# EAGLE schematic GTA04b7 (EAGLE 7.4.0), part 2 of 3
## Sheet 16 of 38
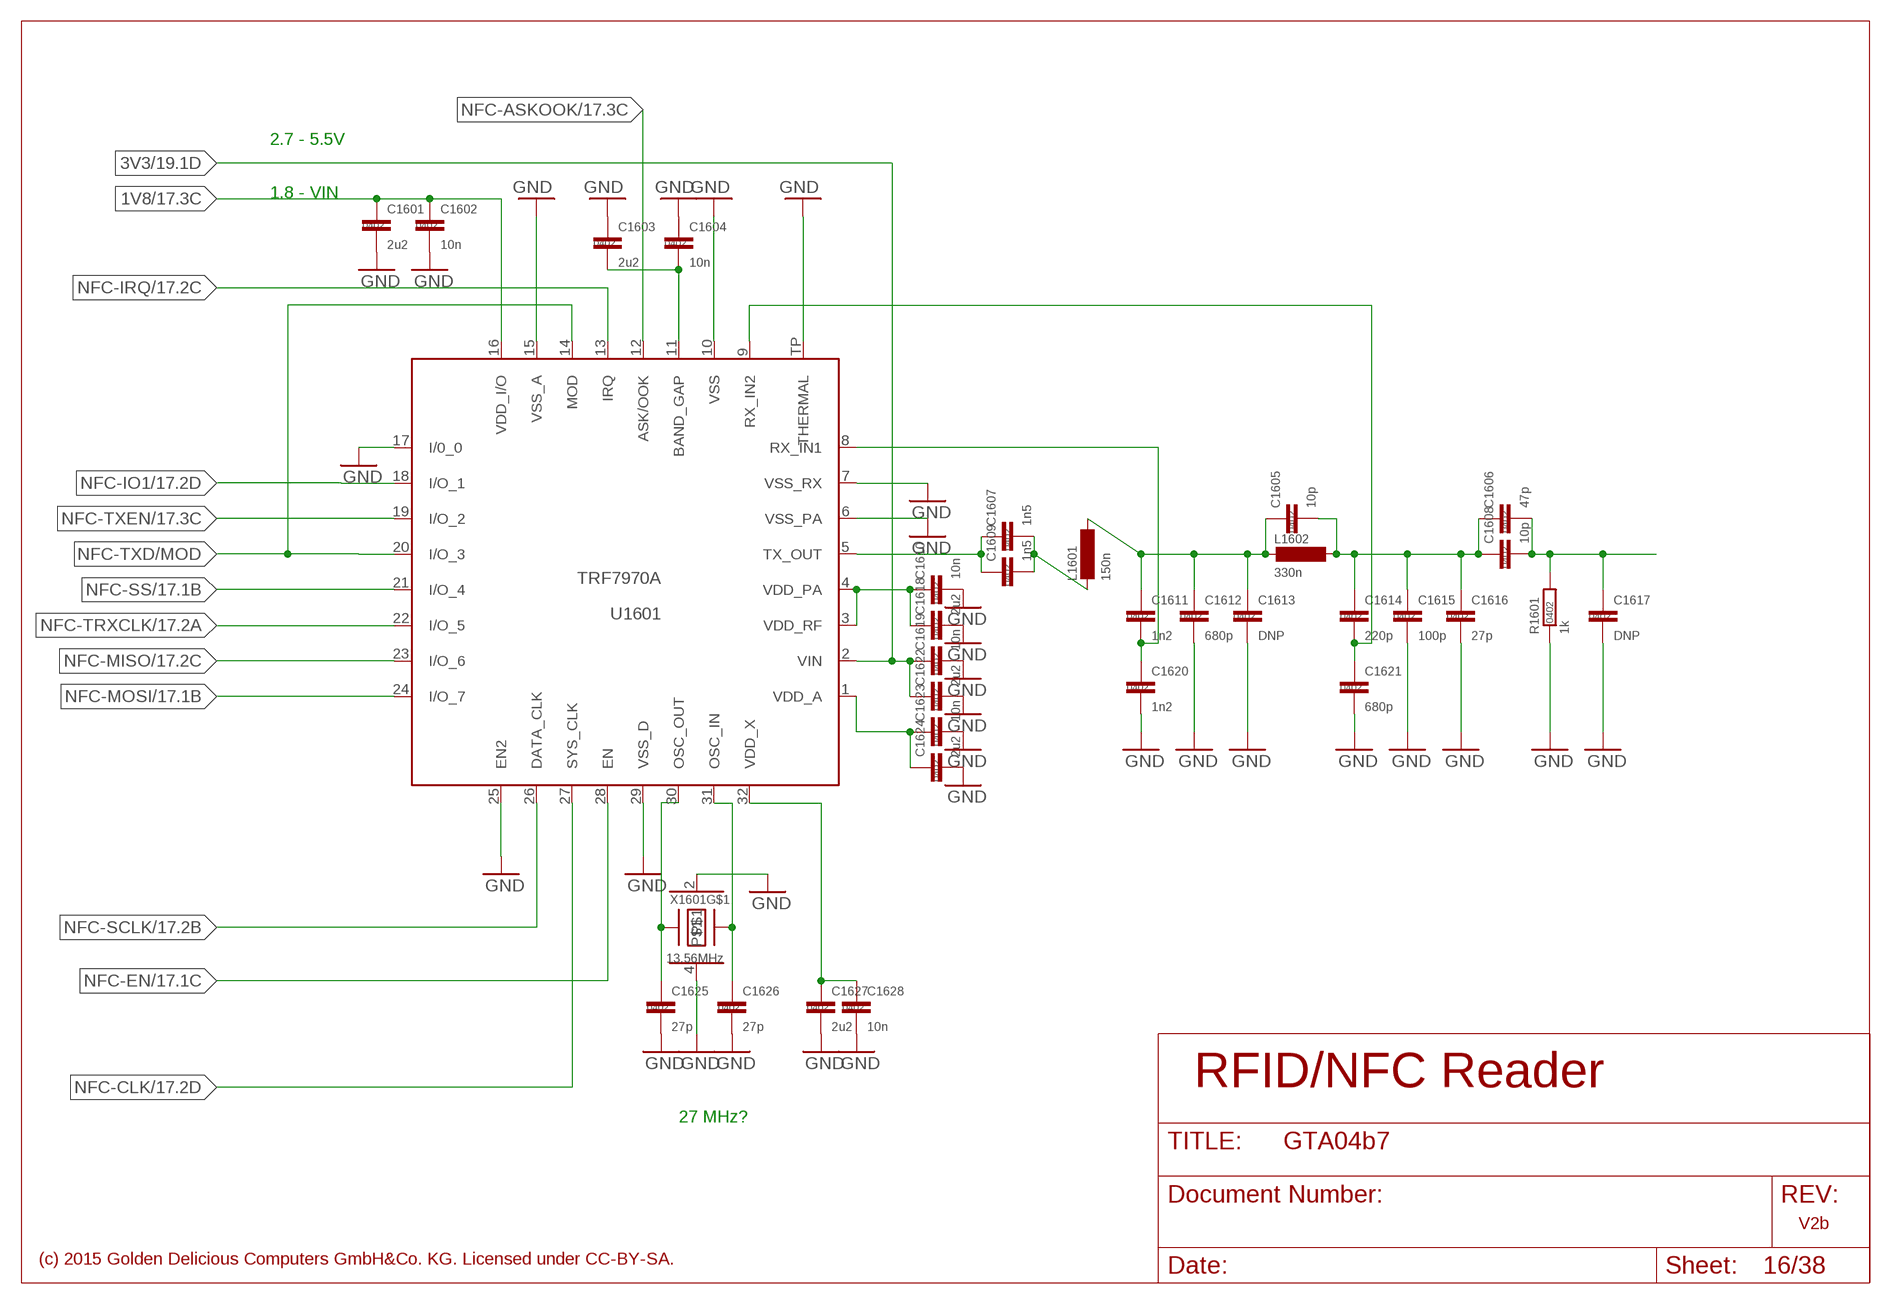
[diagram p19: schematic, sheet 16]

### Parts
C1601  2u2  C0402  [SMD-0402]
C1602  10n  C0402  [SMD-0402]
C1603  2u2  C0402  [SMD-0402]
C1604  10n  C0402  [SMD-0402]
C1605  10p  C0402  [SMD-0402]
C1606  47p  C0402  [SMD-0402]
C1607  1n5  C0402  [SMD-0402]
C1608  10p  C0402  [SMD-0402]
C1609  1n5  C0402  [SMD-0402]
C1610  10n  C0402  [SMD-0402]
C1611  1n2  C0402  [SMD-0402]
C1612  680p  C0402  [SMD-0402]
C1613  DNP  C0402  [SMD-0402]
C1614  220p  C0402  [SMD-0402]
C1615  100p  C0402  [SMD-0402]
C1616  27p  C0402  [SMD-0402]
C1617  DNP  C0402  [SMD-0402]
C1618  2u2  C0402  [SMD-0402]
C1619  10n  C0402  [SMD-0402]
C1620  1n2  C0402  [SMD-0402]
C1621  680p  C0402  [SMD-0402]
C1622  2u2  C0402  [SMD-0402]
C1623  10n  C0402  [SMD-0402]
C1624  2u2  C0402  [SMD-0402]
C1625  27p  C0402  [SMD-0402]
C1626  27p  C0402  [SMD-0402]
C1627  2u2  C0402  [SMD-0402]
C1628  10n  C0402  [SMD-0402]
L1601  150n  L0603  [SMD-0603]
L1602  330n  L0603  [SMD-0603]
R1601  1k  R0402  [SMD-0402]
U1601  TRF7970A  TRF796XS-PQFP-N32(RHB)  [TRF7960_61]
X1601  13.56MHz  XTAL-4-3225  [XO-3225]

### Nets
1V8 [GND]: C1601.1 C1602.1 U1601.16(VDD_I/O) ; also sheet 7,8,9,10,11,12,13,17,19,20
3V3: C1619.1 C1622.1 U1601.2(VIN) ; also sheet 7,8,9,10,13,15,19,20
GND [GND]: C1601.2 C1602.2 C1603.1 C1604.1 C1610.2 C1612.2 C1613.2 C1615.2 C1616.2 C1617.2 C1618.2 C1619.2 C1620.2 C1621.2 C1622.2 C1623.2 C1624.2 C1625.2 C1626.2 C1627.2 C1628.2 R1601.1 U1601.6(VSS_PA) U1601.7(VSS_RX) U1601.10(VSS) U1601.15(VSS_A) U1601.17(I/0_0) U1601.25(EN2) U1601.29(VSS_D) U1601.TP(THERMAL) X1601.2 X1601.4 ; also sheet 1,2,3,4,5,6,7,8,9,10,11,12,13,14,15,17,18,19,20
N$316: C1603.2 C1604.2 U1601.11(BAND_GAP)
N$317 [50 Ohm]: C1607.1 C1609.1 U1601.5(TX_OUT)
N$318 [50 Ohm]: C1607.2 C1609.2 L1601.2
N$320 [50 Ohm]: C1605.1 C1611.1 C1612.1 C1613.1 L1601.1 L1602.2
N$321 [50 Ohm]: C1611.2 C1620.1 U1601.8(RX_IN1)
N$322 [50 Ohm]: C1605.2 C1606.1 C1608.1 C1614.1 C1615.1 C1616.1 L1602.1
N$323 [50 Ohm]: C1614.2 C1621.1 U1601.9(RX_IN2)
N$324: C1610.1 C1618.1 U1601.3(VDD_RF) U1601.4(VDD_PA)
N$325: C1623.1 C1624.1 U1601.1(VDD_A)
N$326: C1625.1 U1601.30(OSC_OUT) X1601.1
N$327: C1626.1 U1601.31(OSC_IN) X1601.3
N$328: C1627.1 C1628.1 U1601.32(VDD_X)
NFC-ANT [50 Ohm]: C1606.2 C1608.2 C1617.1 R1601.2 ; also sheet 18
NFC-ASKOOK: U1601.12(ASK/OOK) ; also sheet 17
NFC-CLK: U1601.27(SYS_CLK) ; also sheet 17
NFC-EN: U1601.28(EN) ; also sheet 17
NFC-IO1: U1601.18(I/O_1) ; also sheet 17
NFC-IRQ: U1601.13(IRQ) ; also sheet 17
NFC-MISO: U1601.23(I/O_6) ; also sheet 17
NFC-MOSI: U1601.24(I/O_7) ; also sheet 17
NFC-SCLK: U1601.26(DATA_CLK) ; also sheet 17
NFC-SS: U1601.21(I/O_4) ; also sheet 17
NFC-TRXCLK: U1601.22(I/O_5) ; also sheet 17
NFC-TXD/MOD: U1601.14(MOD) U1601.20(I/O_3)
NFC-TXEN: U1601.19(I/O_2) ; also sheet 17

### Notes on the sheet
- 2.7 - 5.5V
- 1.8 - VIN
- RFID/NFC Reader
- 27 MHz?
- V2b
- (c) 2015 Golden Delicious Computers GmbH&Co. KG. Licensed under CC-BY-SA.

## Sheet 17 of 38
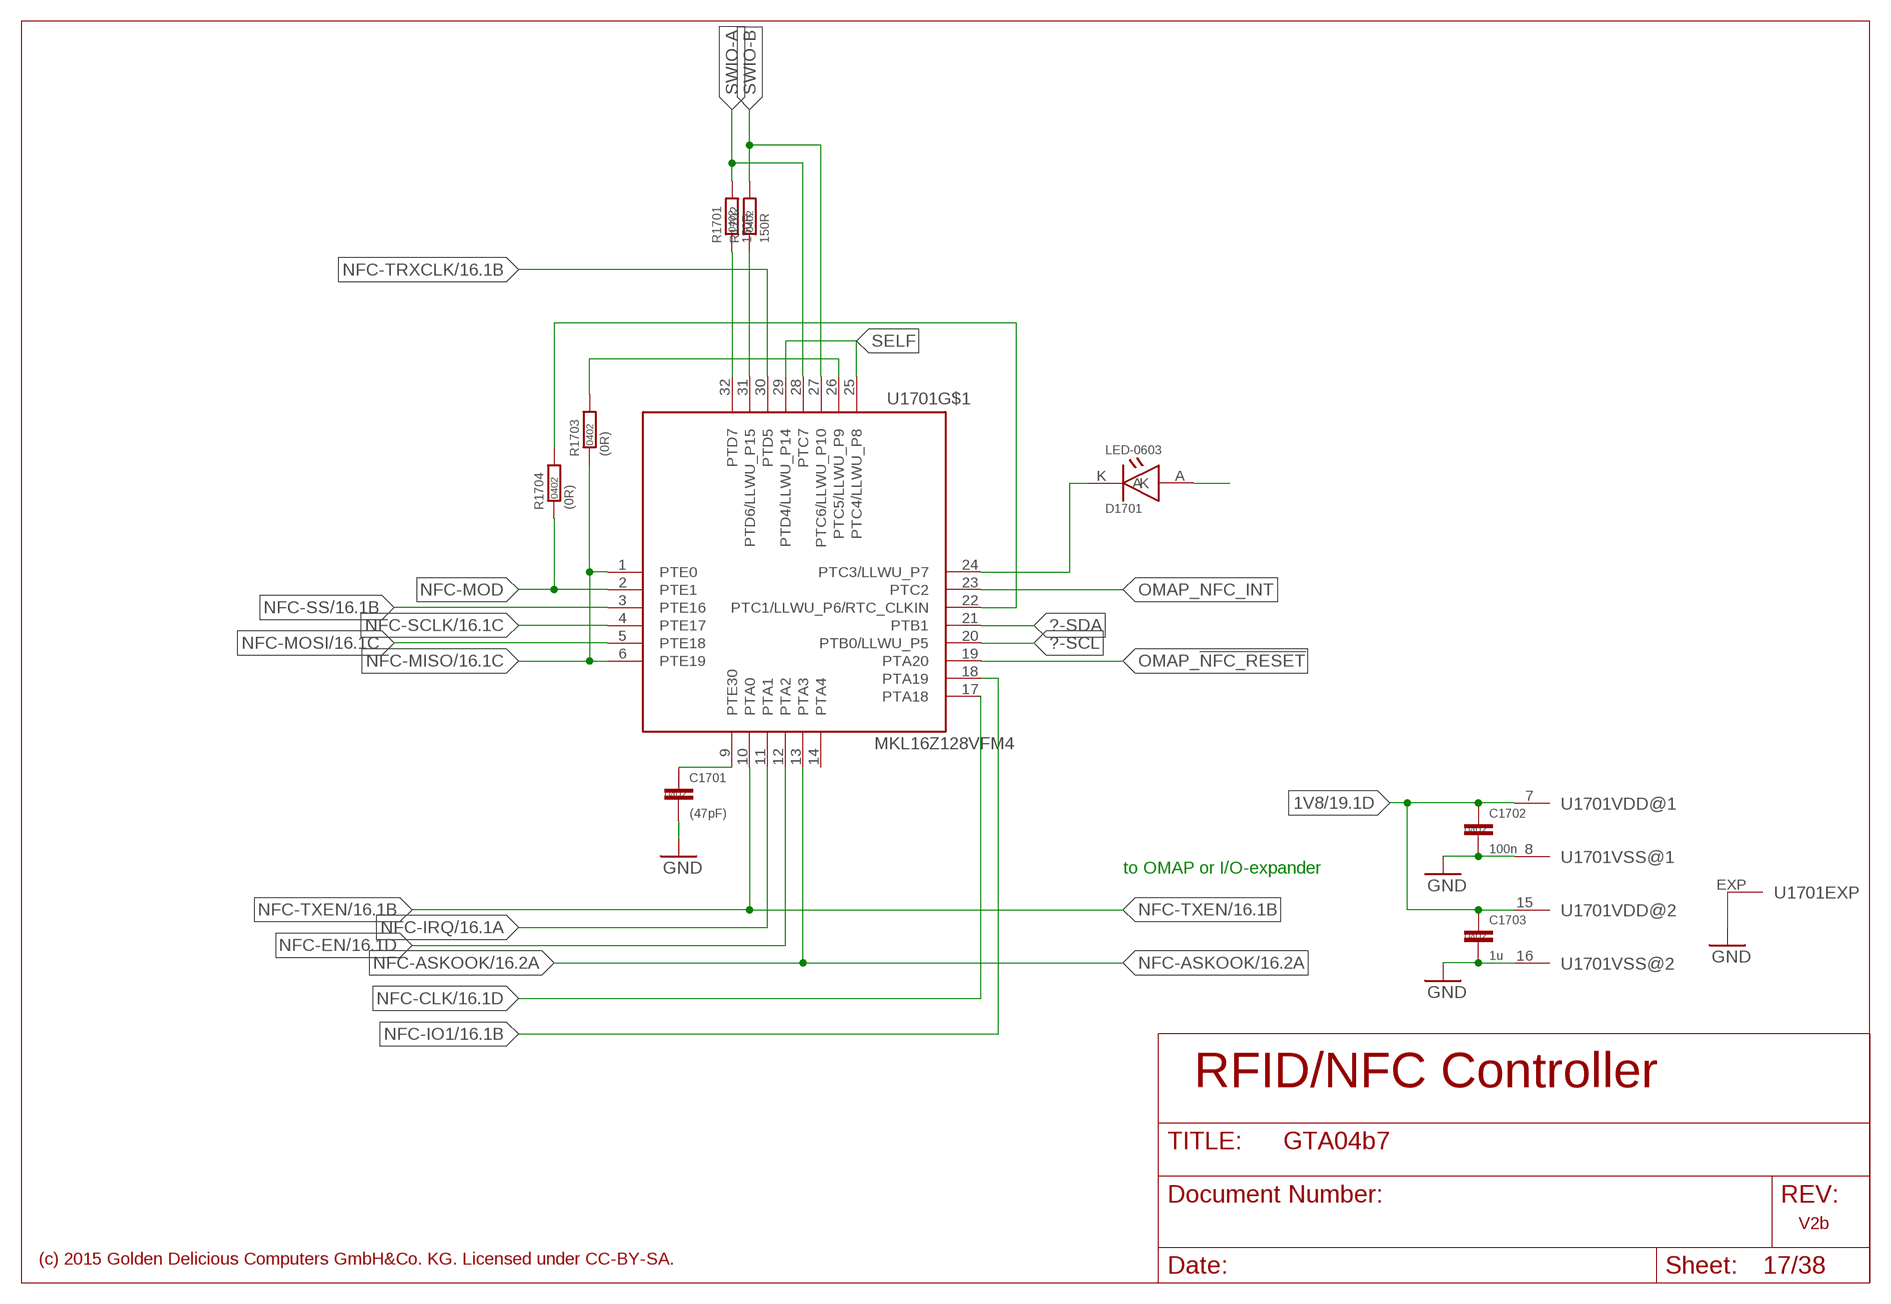
[diagram p20: schematic, sheet 17]

### Parts
C1701  (47pF)  C0402  [SMD-0402]
C1702  100n  C0402  [SMD-0402]
C1703  1u  C0402  [SMD-0402]
D1701  LED-0603  [SMD-0603D]
R1701  150R  R0402  [SMD-0402]
R1702  150R  R0402  [SMD-0402]
R1703  (0R)  R0402  [SMD-0402]
R1704  (0R)  R0402  [SMD-0402]
U1701  MKL16Z128VFM4  MKL16Z32VFM4  [QFN-32+E-0.5]

### Nets
1V8 [GND]: C1702.1 C1703.1 U1701.7(VDD@1:PIN) U1701.15(VDD@2:PIN) ; also sheet 7,8,9,10,11,12,13,16,19,20
?-SCL: U1701.20(PTB0/LLWU_P5)
?-SDA: U1701.21(PTB1)
GND [GND]: C1701.2 C1702.2 C1703.2 U1701.8(VSS@1:PIN) U1701.16(VSS@2:PIN) U1701.EXP(EXP:PIN) ; also sheet 1,2,3,4,5,6,7,8,9,10,11,12,13,14,15,16,18,19,20
N$334: D1701.K U1701.24(PTC3/LLWU_P7)
N$335: D1701.A
N$336: R1703.2 U1701.26(PTC5/LLWU_P9)
N$337: R1701.1 U1701.32(PTD7)
N$345: C1701.1 U1701.9(PTE30)
N$348: R1704.2 U1701.22(PTC1/LLWU_P6/RTC_CLKIN)
N$350: R1702.1 U1701.31(PTD6/LLWU_P15)
NFC-ASKOOK: U1701.13(PTA3) ; also sheet 16
NFC-CLK: U1701.17(PTA18) ; also sheet 16
NFC-EN: U1701.12(PTA2) ; also sheet 16
NFC-IO1: U1701.18(PTA19) ; also sheet 16
NFC-IRQ: U1701.11(PTA1) ; also sheet 16
NFC-MISO: R1703.1 U1701.1(PTE0) U1701.6(PTE19) ; also sheet 16
NFC-MOD: R1704.1 U1701.2(PTE1)
NFC-MOSI: U1701.5(PTE18) ; also sheet 16
NFC-SCLK: U1701.4(PTE17) ; also sheet 16
NFC-SS: U1701.3(PTE16) ; also sheet 16
NFC-TRXCLK: U1701.30(PTD5) ; also sheet 16
NFC-TXEN: U1701.10(PTA0) ; also sheet 16
OMAP_!NFC_RESET: U1701.19(PTA20)
OMAP_NFC_INT: U1701.23(PTC2)
SELF: U1701.25(PTC4/LLWU_P8) U1701.29(PTD4/LLWU_P14)
SWIO-A: R1701.2 U1701.28(PTC7)
SWIO-B: R1702.2 U1701.27(PTC6/LLWU_P10)
Unconnected: U1701.14(PTA4)

### Notes on the sheet
- to OMAP or I/O-expander
- RFID/NFC Controller
- V2b
- (c) 2015 Golden Delicious Computers GmbH&Co. KG. Licensed under CC-BY-SA.

## Sheet 18 of 38
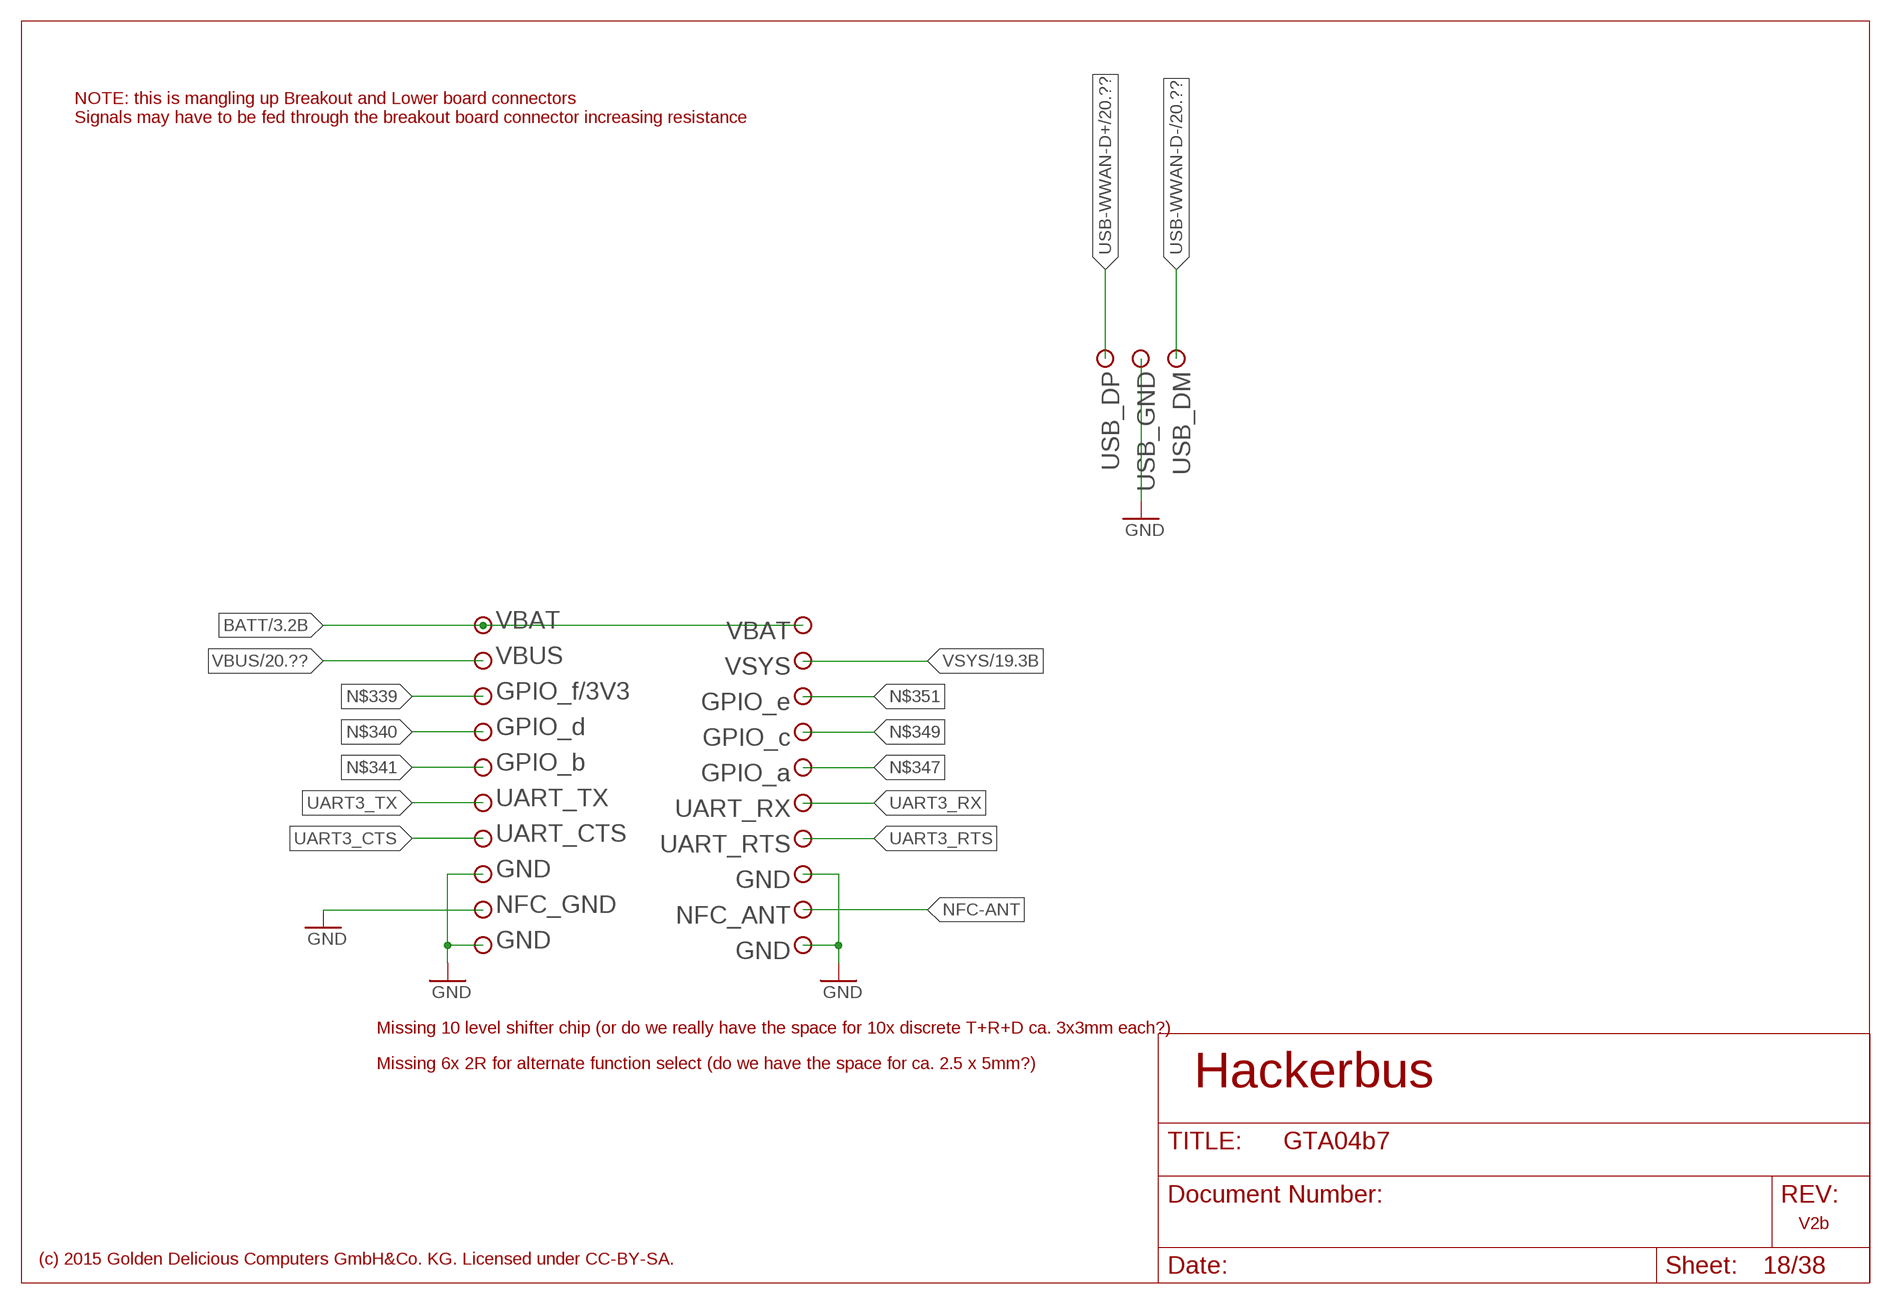
[diagram p21: schematic, sheet 18]

### Parts
TP1  GND  PIN-PIN-0.8  [1PIN-1.5-0.8]
TP3  GND  PIN-PIN-0.8  [1PIN-1.5-0.8]
TP4  GND  PIN-PIN-0.8  [1PIN-1.5-0.8]
TP5  GND  PIN-PIN-0.8  [1PIN-1.5-0.8]
TP6  UART_CTS  PIN-PIN-0.8  [1PIN-1.5-0.8]
TP7  UART_TX  PIN-PIN-0.8  [1PIN-1.5-0.8]
TP8  GPIO_b  PIN-PIN-0.8  [1PIN-1.5-0.8]
TP9  GPIO_d  PIN-PIN-0.8  [1PIN-1.5-0.8]
TP10  GPIO_f/3V3  PIN-PIN-0.8  [1PIN-1.5-0.8]
TP11  VBUS  PIN-PIN-0.8  [1PIN-1.5-0.8]
TP12  VBAT  PIN-PIN-0.8  [1PIN-1.5-0.8]
TP13  UART_RTS  PIN-PIN-0.8  [1PIN-1.5-0.8]
TP14  UART_RX  PIN-PIN-0.8  [1PIN-1.5-0.8]
TP15  GPIO_a  PIN-PIN-0.8  [1PIN-1.5-0.8]
TP16  GPIO_c  PIN-PIN-0.8  [1PIN-1.5-0.8]
TP17  GPIO_e  PIN-PIN-0.8  [1PIN-1.5-0.8]
TP18  VSYS  PIN-PIN-0.8  [1PIN-1.5-0.8]
TP19  VBAT  PIN-PIN-0.8  [1PIN-1.5-0.8]
TP20  USB_DP  PIN-PIN-0.8  [1PIN-1.5-0.8]
TP21  USB_GND  PIN-PIN-0.8  [1PIN-1.5-0.8]
TP22  USB_DM  PIN-PIN-0.8  [1PIN-1.5-0.8]
TP25  NFC_GND  PIN-PIN-0.8  [1PIN-1.5-0.8]  (not fitted in variant Default)
TP26  NFC_ANT  PIN-PIN-0.8  [1PIN-1.5-0.8]  (not fitted in variant Default)

### Nets
BATT [Battery]: TP12.1 TP19.1 ; also sheet 3,5
GND [GND]: TP1.1 TP3.1 TP4.1 TP5.1 TP21.1 TP25.1 ; also sheet 1,2,3,4,5,6,7,8,9,10,11,12,13,14,15,16,17,19,20
N$339: TP10.1
N$340: TP9.1
N$341: TP8.1
N$347: TP15.1
N$349: TP16.1
N$351: TP17.1
NFC-ANT [50 Ohm]: TP26.1 ; also sheet 16
UART3_CTS: TP6.1
UART3_RTS: TP13.1
UART3_RX: TP14.1
UART3_TX: TP7.1
USB-WWAN-D+ [90 Ohm]: TP20.1 ; also sheet 2,6,20
USB-WWAN-D- [90 Ohm]: TP22.1 ; also sheet 2,6,20
VBUS [Battery]: TP11.1 ; also sheet 2,3,20
VSYS [GND]: TP18.1 ; also sheet 3,4,9,14,15,19,20

### Notes on the sheet
- NOTE: this is mangling up Breakout and Lower board connectors
  Signals may have to be fed through the breakout board connector increasing resistance
- Missing 10 level shifter chip (or do we really have the space for 10x discrete T+R+D ca. 3x3mm each?)
- Missing 6x 2R for alternate function select (do we have the space for ca. 2.5 x 5mm?)
- Hackerbus
- V2b
- (c) 2015 Golden Delicious Computers GmbH&Co. KG. Licensed under CC-BY-SA.

## Sheet 19 of 38
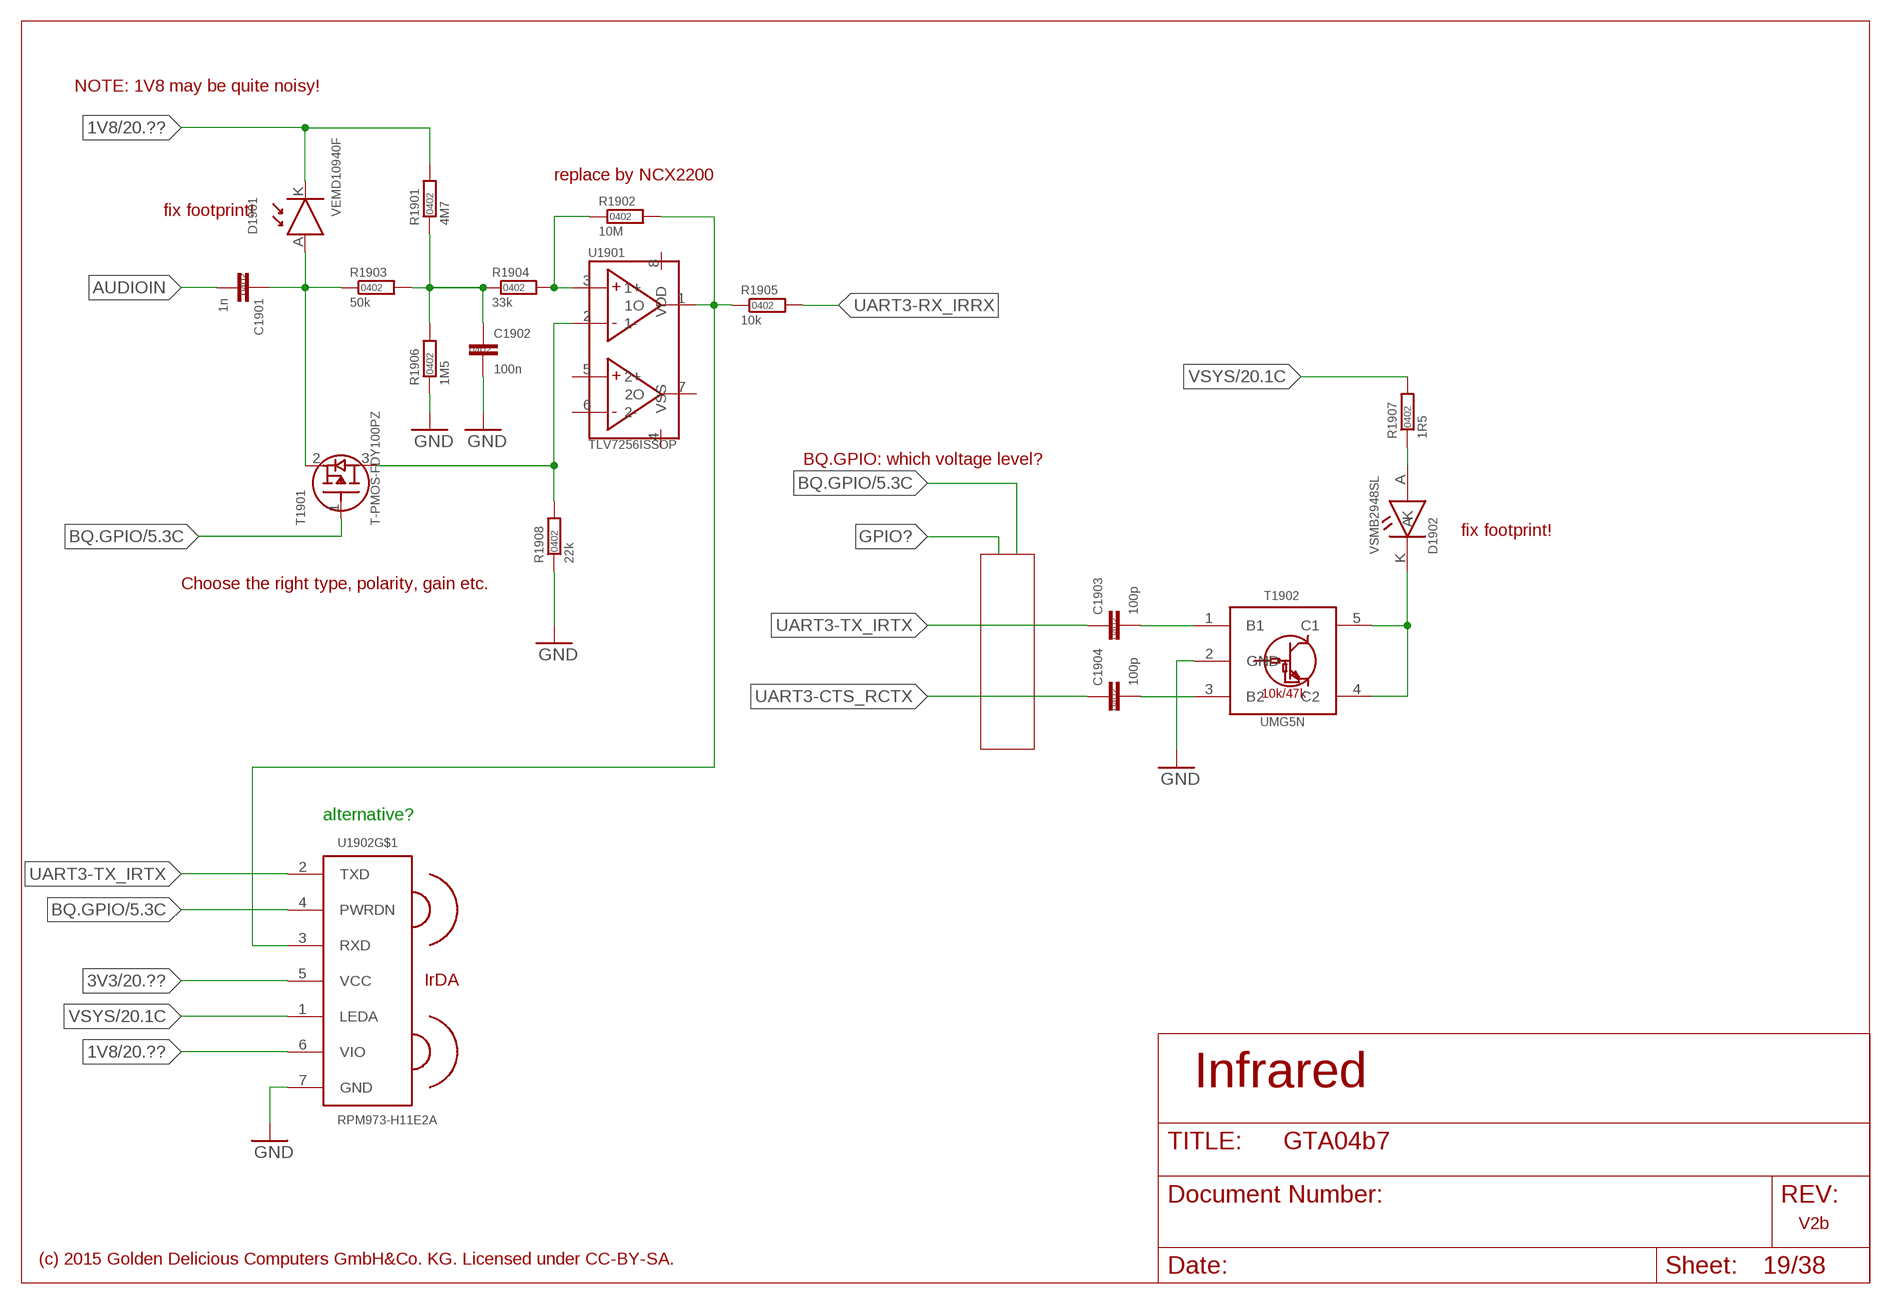
[diagram p22: schematic, sheet 19]

### Parts
C1901  1n  C0402  [SMD-0402]
C1902  100n  C0402  [SMD-0402]
C1903  100p  C0402  [SMD-0402]
C1904  100p  C0402  [SMD-0402]
D1901  VEMD10940F  VEMD2023SLX01  [VSMB2948SL]
D1902  VSMB2948SL  LED-VSMB2943SL  [VSMB2948SL]
R1901  4M7  R0402  [SMD-0402]
R1902  10M  R0402  [SMD-0402]
R1903  50k  R0402  [SMD-0402]
R1904  33k  R0402  [SMD-0402]
R1905  10k  R0402  [SMD-0402]
R1906  1M5  R0402  [SMD-0402]
R1907  1R5  R0402  [SMD-0402]
R1908  22k  R0402  [SMD-0402]
T1901  T-PMOS-FDY100PZ  [SC89-3]
T1902  UMG5N  T-NPN-DUAL-UMG5N  [SC88A]
U1901  TLV7256ISSOP  [PW_R-PDSO-G08]
U1902  RPM973-H11E2A  [RPM973-H11E2A]

### Nets
1V8 [GND]: D1901.K R1901.2 U1902.6(VIO) ; also sheet 7,8,9,10,11,12,13,16,17,20
3V3: U1902.5(VCC) ; also sheet 7,8,9,10,13,15,16,20
AUDIOIN: C1901.2
BQ.GPIO: T1901.1(P$GATE) U1902.4(PWRDN) ; also sheet 5
GND [GND]: C1902.2 R1906.1 R1908.1 T1902.2(GND) U1902.7(GND) ; also sheet 1,2,3,4,5,6,7,8,9,10,11,12,13,14,15,16,17,18,20
N$51: D1902.K T1902.4(C2) T1902.5(C1)
N$127: C1903.2 T1902.1(B1)
N$169 [GND]: D1902.A R1907.1
N$170: C1902.1 R1901.1 R1903.2 R1904.1 R1906.2
N$171: C1901.1 D1901.A R1903.1 T1901.2(P$SOURCE)
N$329: C1904.2 T1902.3(B2)
N$330: R1902.2 R1905.1 U1901.1(1O) U1902.3(RXD)
N$331: R1908.2 T1901.3(P$DRAIN) U1901.2(1-)
N$332: R1902.1 R1904.2 U1901.3(1+)
UART3-CTS_RCTX: C1904.1
UART3-RX_IRRX: R1905.2
UART3-TX_IRTX: C1903.1 U1902.2(TXD)
VSYS [GND]: R1907.2 U1902.1(LEDA) ; also sheet 3,4,9,14,15,18,20
Unconnected: U1901.5(2+) U1901.6(2-) U1901.7(2O)

### Notes on the sheet
- NOTE: 1V8 may be quite noisy!
- replace by NCX2200
- fix footprint!
- BQ.GPIO: which voltage level?
- fix footprint!
- Choose the right type, polarity, gain etc.
- alternative?
- Infrared
- V2b
- (c) 2015 Golden Delicious Computers GmbH&Co. KG. Licensed under CC-BY-SA.

## Sheet 20 of 38
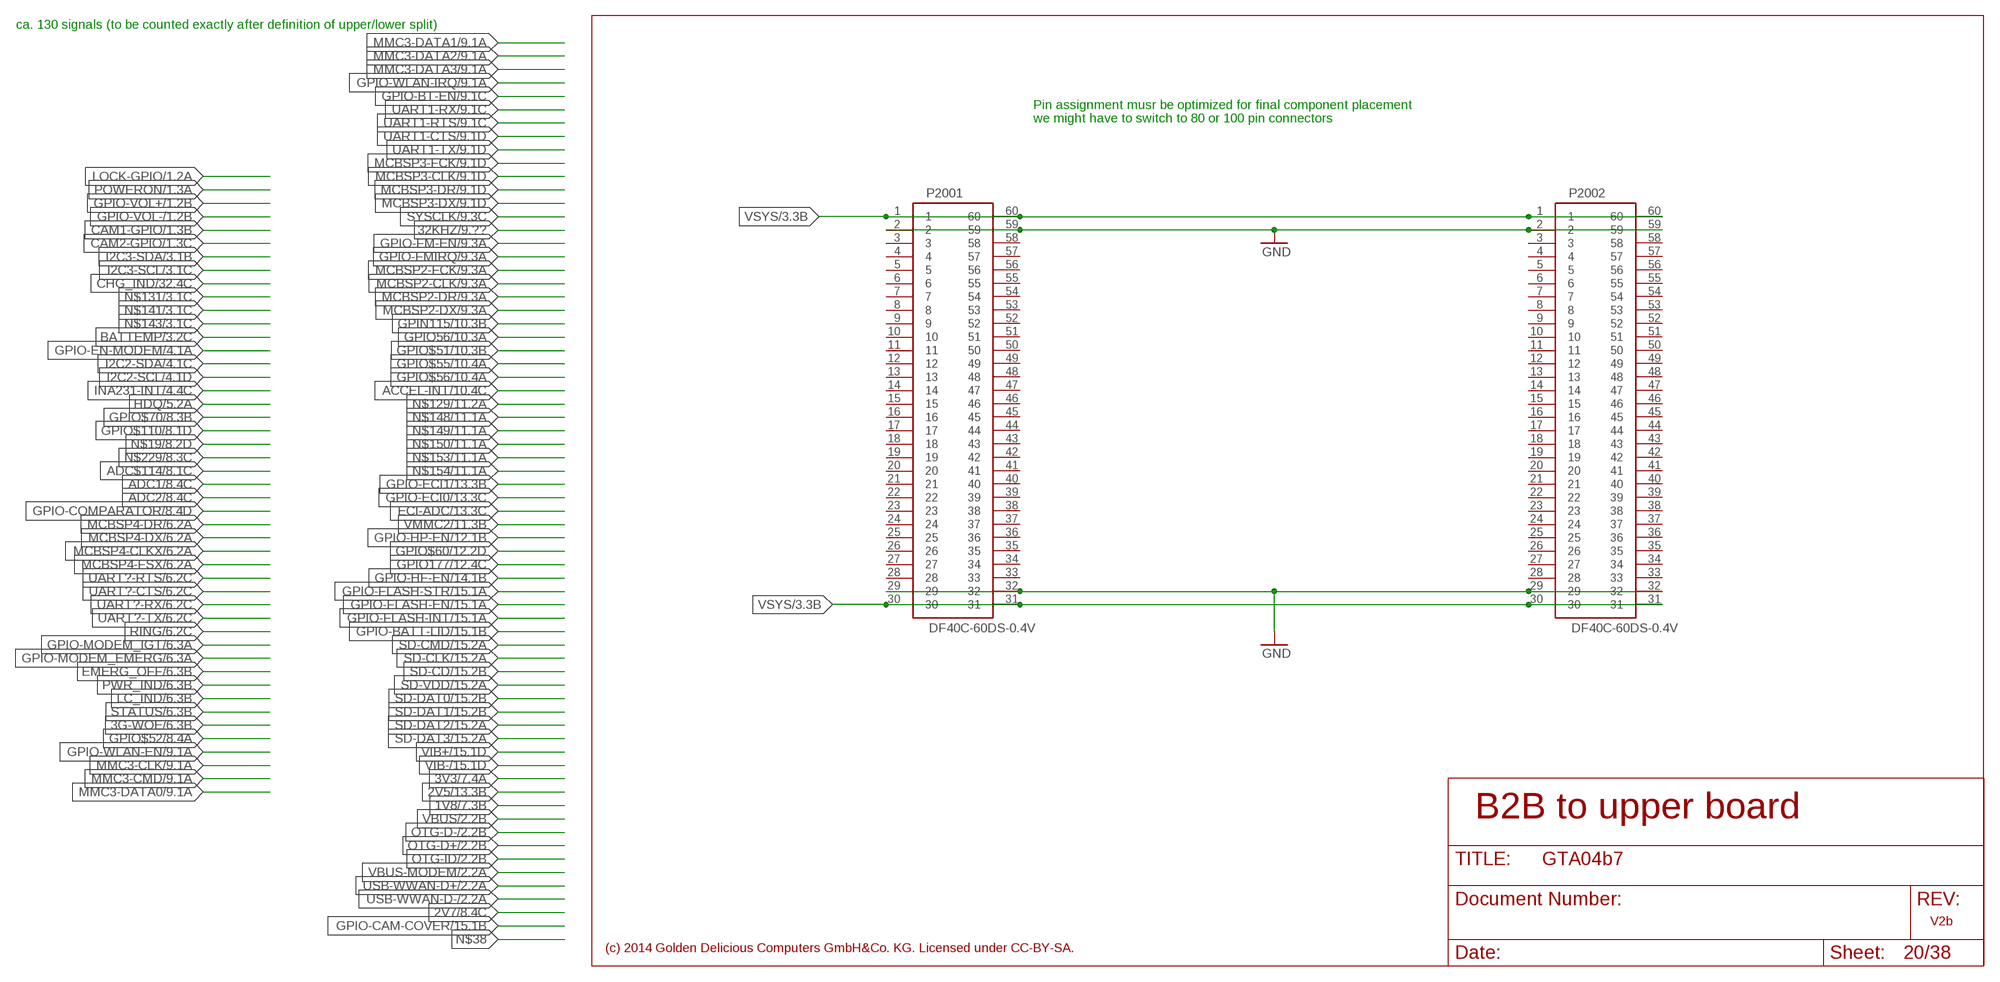
[diagram p23: schematic, sheet 20]

### Parts
P2001  DF40C-60DS-0.4V  [DF40C-60DS-0.4V]
P2002  DF40C-60DS-0.4V  [DF40C-60DS-0.4V]

### Nets
GND [GND]: P2001.2 P2001.29 P2001.32 P2001.59 P2002.2 P2002.29 P2002.32 P2002.59 ; also sheet 1,2,3,4,5,6,7,8,9,10,11,12,13,14,15,16,17,18,19
VSYS [GND]: P2001.1 P2001.30 P2001.31 P2001.60 P2002.1 P2002.30 P2002.31 P2002.60 ; also sheet 3,4,9,14,15,18,19
Unconnected: P2001.3 P2001.4 P2001.5 P2001.6 P2001.7 P2001.8 P2001.9 P2001.10 P2001.11 P2001.12 P2001.13 P2001.14 P2001.15 P2001.16 P2001.17 P2001.18 P2001.19 P2001.20 P2001.21 P2001.22 P2001.23 P2001.24 P2001.25 P2001.26 P2001.27 P2001.28 P2001.33 P2001.34 P2001.35 P2001.36 P2001.37 P2001.38 P2001.39 P2001.40 P2001.41 P2001.42 P2001.43 P2001.44 P2001.45 P2001.46 P2001.47 P2001.48 P2001.49 P2001.50 P2001.51 P2001.52 P2001.53 P2001.54 P2001.55 P2001.56 P2001.57 P2001.58 P2002.3 P2002.4 P2002.5 P2002.6 P2002.7 P2002.8 P2002.9 P2002.10 P2002.11 P2002.12 P2002.13 P2002.14 P2002.15 P2002.16 P2002.17 P2002.18 P2002.19 P2002.20 P2002.21 P2002.22 P2002.23 P2002.24 P2002.25 P2002.26 P2002.27 P2002.28 P2002.33 P2002.34 P2002.35 P2002.36 P2002.37 P2002.38 P2002.39 P2002.40 P2002.41 P2002.42 P2002.43 P2002.44 P2002.45 P2002.46 P2002.47 P2002.48 P2002.49 P2002.50 P2002.51 P2002.52 P2002.53 P2002.54 P2002.55 P2002.56 P2002.57 P2002.58

### Notes on the sheet
- ca. 130 signals (to be counted exactly after definition of upper/lower split)
- Pin assignment musr be optimized for final component placement
- we might have to switch to 80 or 100 pin connectors
- B2B to upper board
- V2b
- (c) 2014 Golden Delicious Computers GmbH&Co. KG. Licensed under CC-BY-SA.

## Sheet 21 of 38
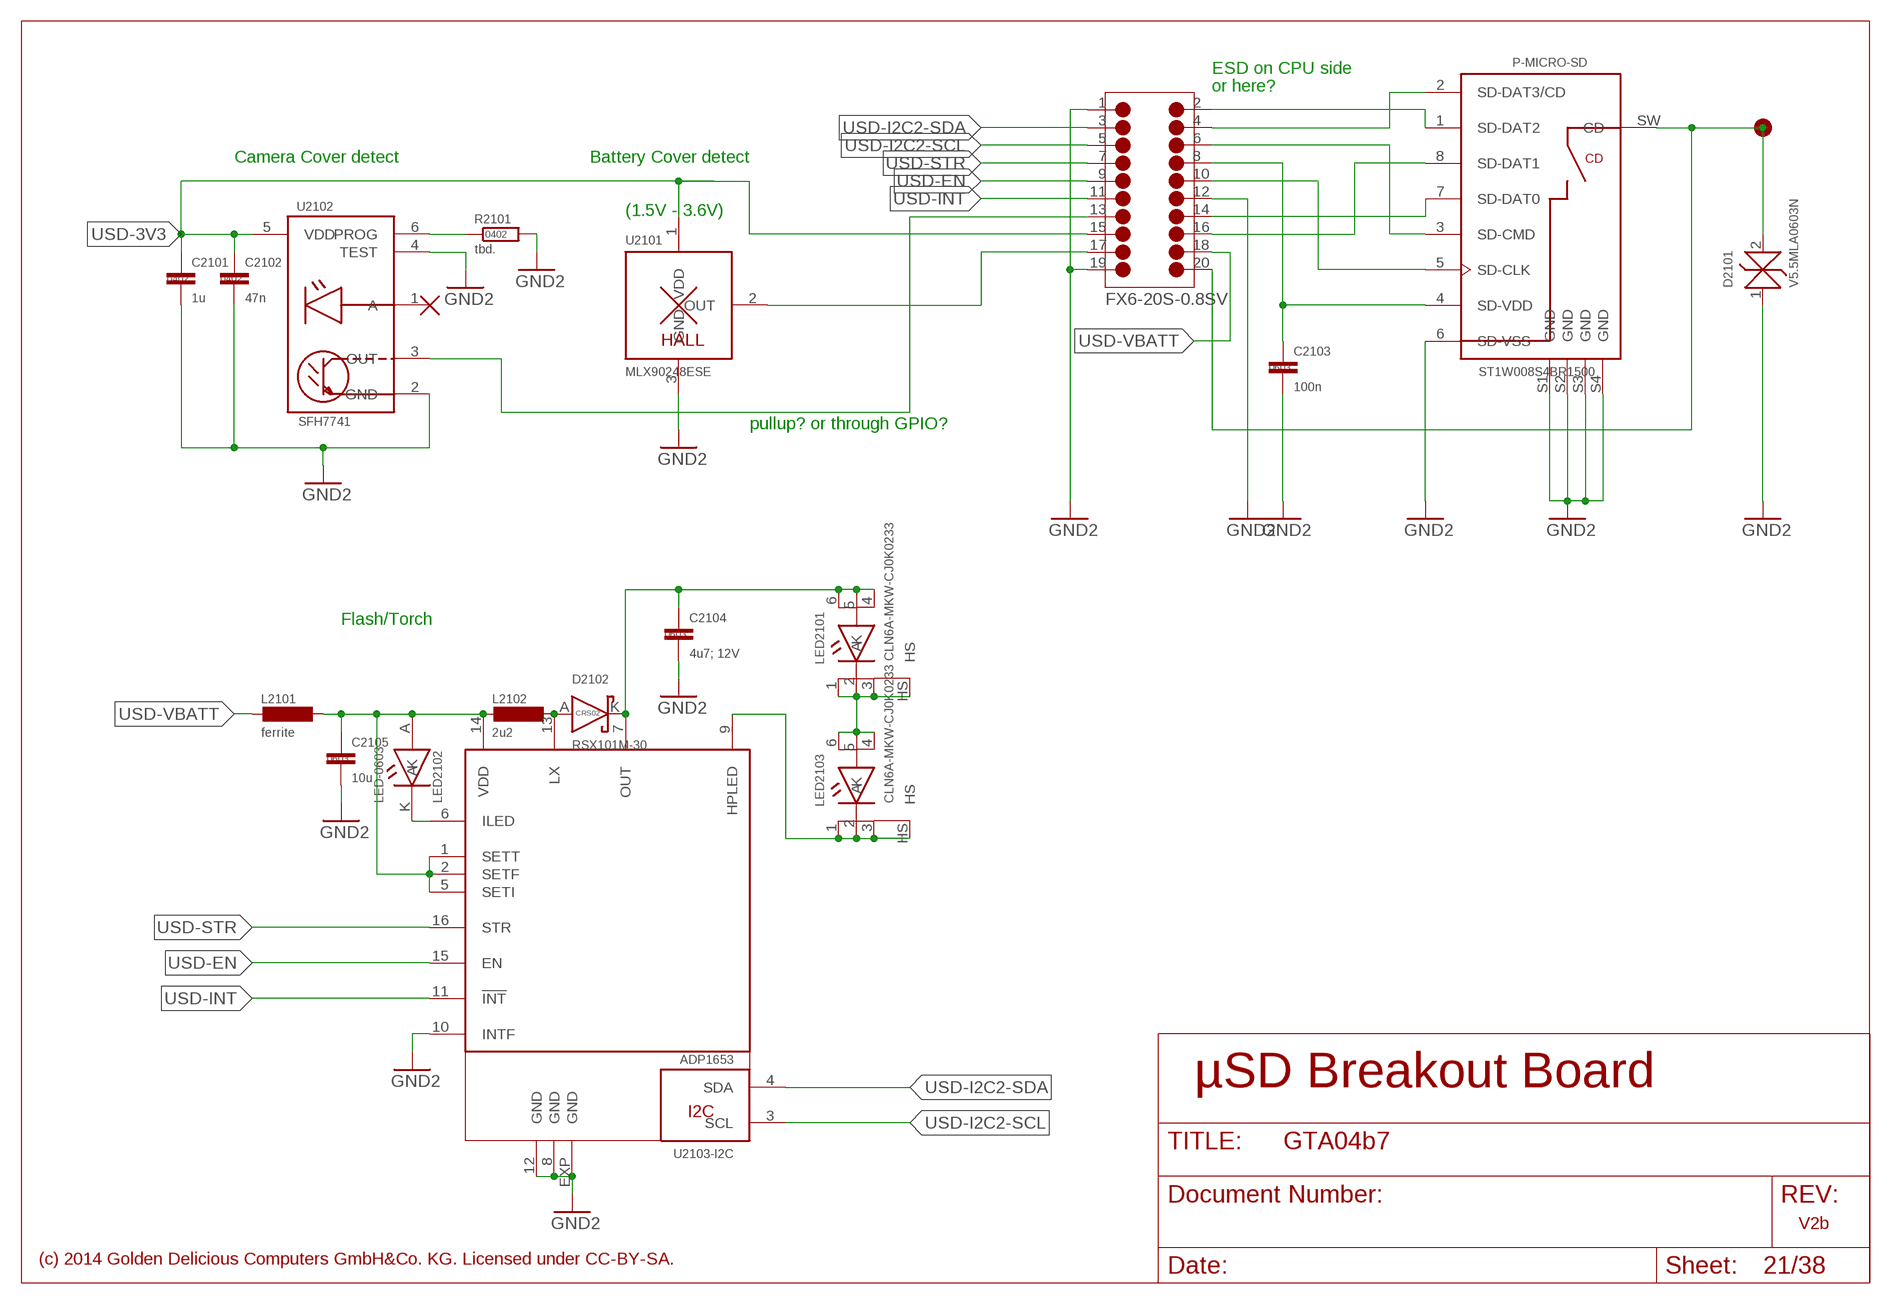
[diagram p24: schematic, sheet 21]

### Parts
C2101  1u  C0402  [SMD-0402]
C2102  47n  C0402  [SMD-0402]
C2103  100n  C0603  [SMD-0603]
C2104  4u7; 12V  C0603  [SMD-0603]
C2105  10u  C0603  [SMD-0603]
CD  TEST-POINT-1.25  [TP-1.25]  (not fitted in variant Full)  (not fitted in variant BB-XM)
D2101  V5.5MLA0603N  [SMD-0603]
D2102  RSX101M-30  D-SCHOTTKY-CRS02  [CRS02]
L2101  ferrite  L0805  [SMD-0805]
L2102  2u2  L0805  [SMD-0805]
LED2101  CLN6A-MKW-CJ0K0233  CLN6A  [CLN6A]
LED2102  LED-0603  [SMD-0603D]
LED2103  CLN6A-MKW-CJ0K0233  CLN6A  [CLN6A]
P2101  FX6-20  FX6-20P-0.8SV  [FX6-20P-0.8SV]
P-MICRO-SD  ST1W008S4BR1500  SD-SLOT+CD  [ST1W008S4BR1500]
R2101  tbd.  R0402  [SMD-0402]
U2101  MLX90248ESE  [SOT23]
U2102  SFH7741  [SFH7741]
U2103  ADP1653  [QFN-16+E-0.5]

### Nets
GND2 [GND]: C2101.2 C2102.2 C2103.2 C2104.2 C2105.2 D2101.1(A) P2101.1 P2101.12 P2101.19 P-MICRO-SD.6(SD-VSS) P-MICRO-SD.S1(GND) P-MICRO-SD.S2(GND) P-MICRO-SD.S3(GND) P-MICRO-SD.S4(GND) R2101.2 U2101.3(GND) U2102.2(GND) U2102.4(TEST) U2103.8(GND:GND) U2103.10(-CTL+DC/DC:INTF) U2103.12(PGND:GND) U2103.EXP(EXP:GND) ; supply symbol labelled GND-2
LID: P2101.17 U2101.2(OUT)
N$12: P2101.13 U2102.3(OUT)
N$17: CD.P D2101.2(K) P2101.20 P-MICRO-SD.SW(CD)
N$23: P2101.2 P-MICRO-SD.1(SD-DAT2)
N$24: P2101.4 P-MICRO-SD.2(SD-DAT3/CD)
N$27: P2101.6 P-MICRO-SD.3(SD-CMD)
N$31: C2103.1 P2101.8 P-MICRO-SD.4(SD-VDD)
N$32: P2101.10 P-MICRO-SD.5(SD-CLK)
N$37: P2101.14 P-MICRO-SD.7(SD-DAT0)
N$39: P2101.16 P-MICRO-SD.8(SD-DAT1)
N$55: LED2101.1(K) LED2101.2(K) LED2101.3(K) LED2101.HS LED2103.4(A) LED2103.5(A) LED2103.6(A)
N$103: D2102.A L2102.1 U2103.13(-CTL+DC/DC:LX)
N$114: R2101.1 U2102.6(PROG)
N$119: C2104.1 D2102.K LED2101.4(A) LED2101.5(A) LED2101.6(A) U2103.7(-CTL+DC/DC:OUT)
N$120: LED2102.K U2103.6(-CTL+DC/DC:ILED)
N$121: LED2103.1(K) LED2103.2(K) LED2103.3(K) LED2103.HS U2103.9(-CTL+DC/DC:HPLED)
USD-1V8: C2105.1 L2101.1 L2102.2 LED2102.A U2103.1(-CTL+DC/DC:SETT) U2103.2(-CTL+DC/DC:SETF) U2103.5(-CTL+DC/DC:SETI) U2103.14(-CTL+DC/DC:VDD)
USD-3V3: C2101.1 C2102.1 P2101.15 U2101.1(VDD) U2102.5(VDD)
USD-EN: P2101.9 U2103.15(-CTL+DC/DC:EN)
USD-I2C2-SCL: P2101.5 U2103.3(-I2C:SCL)
USD-I2C2-SDA: P2101.3 U2103.4(-I2C:SDA)
USD-INT: P2101.11 U2103.11(-CTL+DC/DC:!INT)
USD-STR: P2101.7 U2103.16(-CTL+DC/DC:STR)
USD-VBATT: L2101.2 P2101.18
Unconnected: U2102.1(A)

### Notes on the sheet
- ESD on CPU side
- or here?
- Camera Cover detect | Battery Cover detect
- (1.5V - 3.6V)
- FX6-20S-0.8SV
- pullup? or through GPIO?
- Flash/Torch
- µSD Breakout Board
- V2b
- (c) 2014 Golden Delicious Computers GmbH&Co. KG. Licensed under CC-BY-SA.

## Sheet 22 of 38
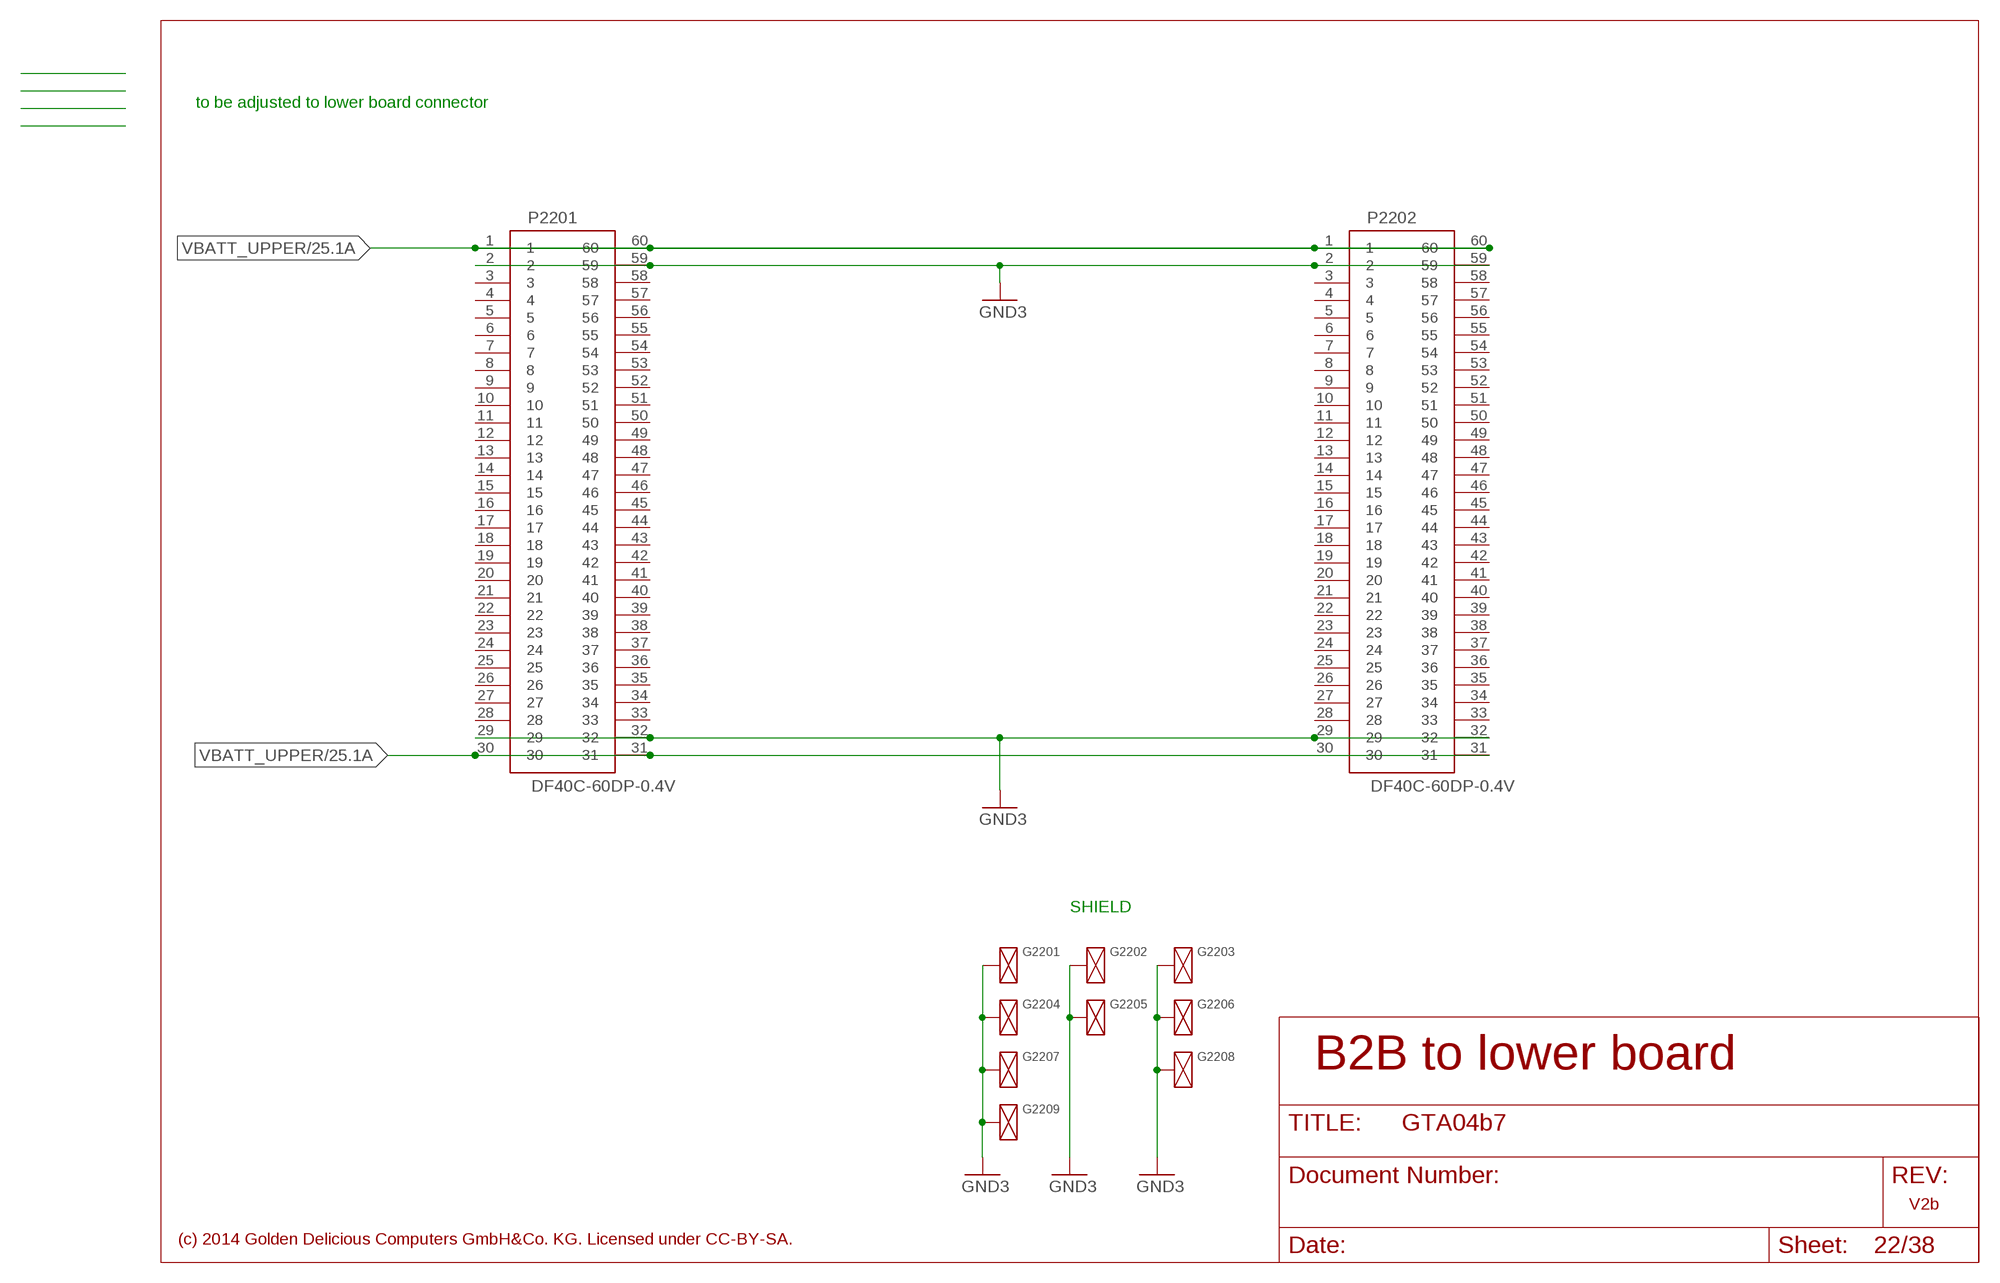
[diagram p25: schematic, sheet 22]

### Parts
G2201  SHIELDN900  [N900-SPRING-A]  (not fitted in variant Full)  (not fitted in variant BB-XM)
G2202  SHIELDN900  [N900-SPRING-A]  (not fitted in variant Full)  (not fitted in variant BB-XM)
G2203  SHIELDPAD-3.5X2.5  [PAD-3.5X2.5]  (not fitted in variant Full)  (not fitted in variant BB-XM)
G2204  SHIELDN900  [N900-SPRING-A]  (not fitted in variant Full)  (not fitted in variant BB-XM)
G2205  SHIELDN900  [N900-SPRING-A]  (not fitted in variant Full)  (not fitted in variant BB-XM)
G2206  SHIELDPAD-3.5X2.5  [PAD-3.5X2.5]  (not fitted in variant Full)  (not fitted in variant BB-XM)
G2207  SHIELDN900  [N900-SPRING-A]  (not fitted in variant Full)  (not fitted in variant BB-XM)
G2208  SHIELDPAD-3.5X2.5  [PAD-3.5X2.5]  (not fitted in variant Full)  (not fitted in variant BB-XM)
G2209  SHIELDN900  [N900-SPRING-A]  (not fitted in variant Full)  (not fitted in variant BB-XM)
P2201  DF40C-60DP-0.4V  [DF40C-60DP-0.4V]
P2202  DF40C-60DP-0.4V  [DF40C-60DP-0.4V]

### Nets
GND3 [GND]: G2201.1(SHIELD) G2202.1(SHIELD) G2203.1(SHIELD) G2204.1(SHIELD) G2205.1(SHIELD) G2206.1(SHIELD) G2207.1(SHIELD) G2208.1(SHIELD) G2209.1(SHIELD) P2201.2 P2201.29 P2201.32 P2201.59 P2202.2 P2202.29 P2202.32 P2202.59 ; supply symbol labelled GND-3 ; also sheet 23,24,25,27,28,29,30,31,32,33
VBATT_UPPER [Battery]: P2201.1 P2201.30 P2201.31 P2201.60 P2202.1 P2202.31 P2202.60 ; also sheet 25,30
Unconnected: P2201.3 P2201.4 P2201.5 P2201.6 P2201.7 P2201.8 P2201.9 P2201.10 P2201.11 P2201.12 P2201.13 P2201.14 P2201.15 P2201.16 P2201.17 P2201.18 P2201.19 P2201.20 P2201.21 P2201.22 P2201.23 P2201.24 P2201.25 P2201.26 P2201.27 P2201.28 P2201.33 P2201.34 P2201.35 P2201.36 P2201.37 P2201.38 P2201.39 P2201.40 P2201.41 P2201.42 P2201.43 P2201.44 P2201.45 P2201.46 P2201.47 P2201.48 P2201.49 P2201.50 P2201.51 P2201.52 P2201.53 P2201.54 P2201.55 P2201.56 P2201.57 P2201.58 P2202.3 P2202.4 P2202.5 P2202.6 P2202.7 P2202.8 P2202.9 P2202.10 P2202.11 P2202.12 P2202.13 P2202.14 P2202.15 P2202.16 P2202.17 P2202.18 P2202.19 P2202.20 P2202.21 P2202.22 P2202.23 P2202.24 P2202.25 P2202.26 P2202.27 P2202.28 P2202.30 P2202.33 P2202.34 P2202.35 P2202.36 P2202.37 P2202.38 P2202.39 P2202.40 P2202.41 P2202.42 P2202.43 P2202.44 P2202.45 P2202.46 P2202.47 P2202.48 P2202.49 P2202.50 P2202.51 P2202.52 P2202.53 P2202.54 P2202.55 P2202.56 P2202.57 P2202.58

### Notes on the sheet
- to be adjusted to lower board connector
- SHIELD
- B2B to lower board
- V2b
- (c) 2014 Golden Delicious Computers GmbH&Co. KG. Licensed under CC-BY-SA.

## Sheet 23 of 38
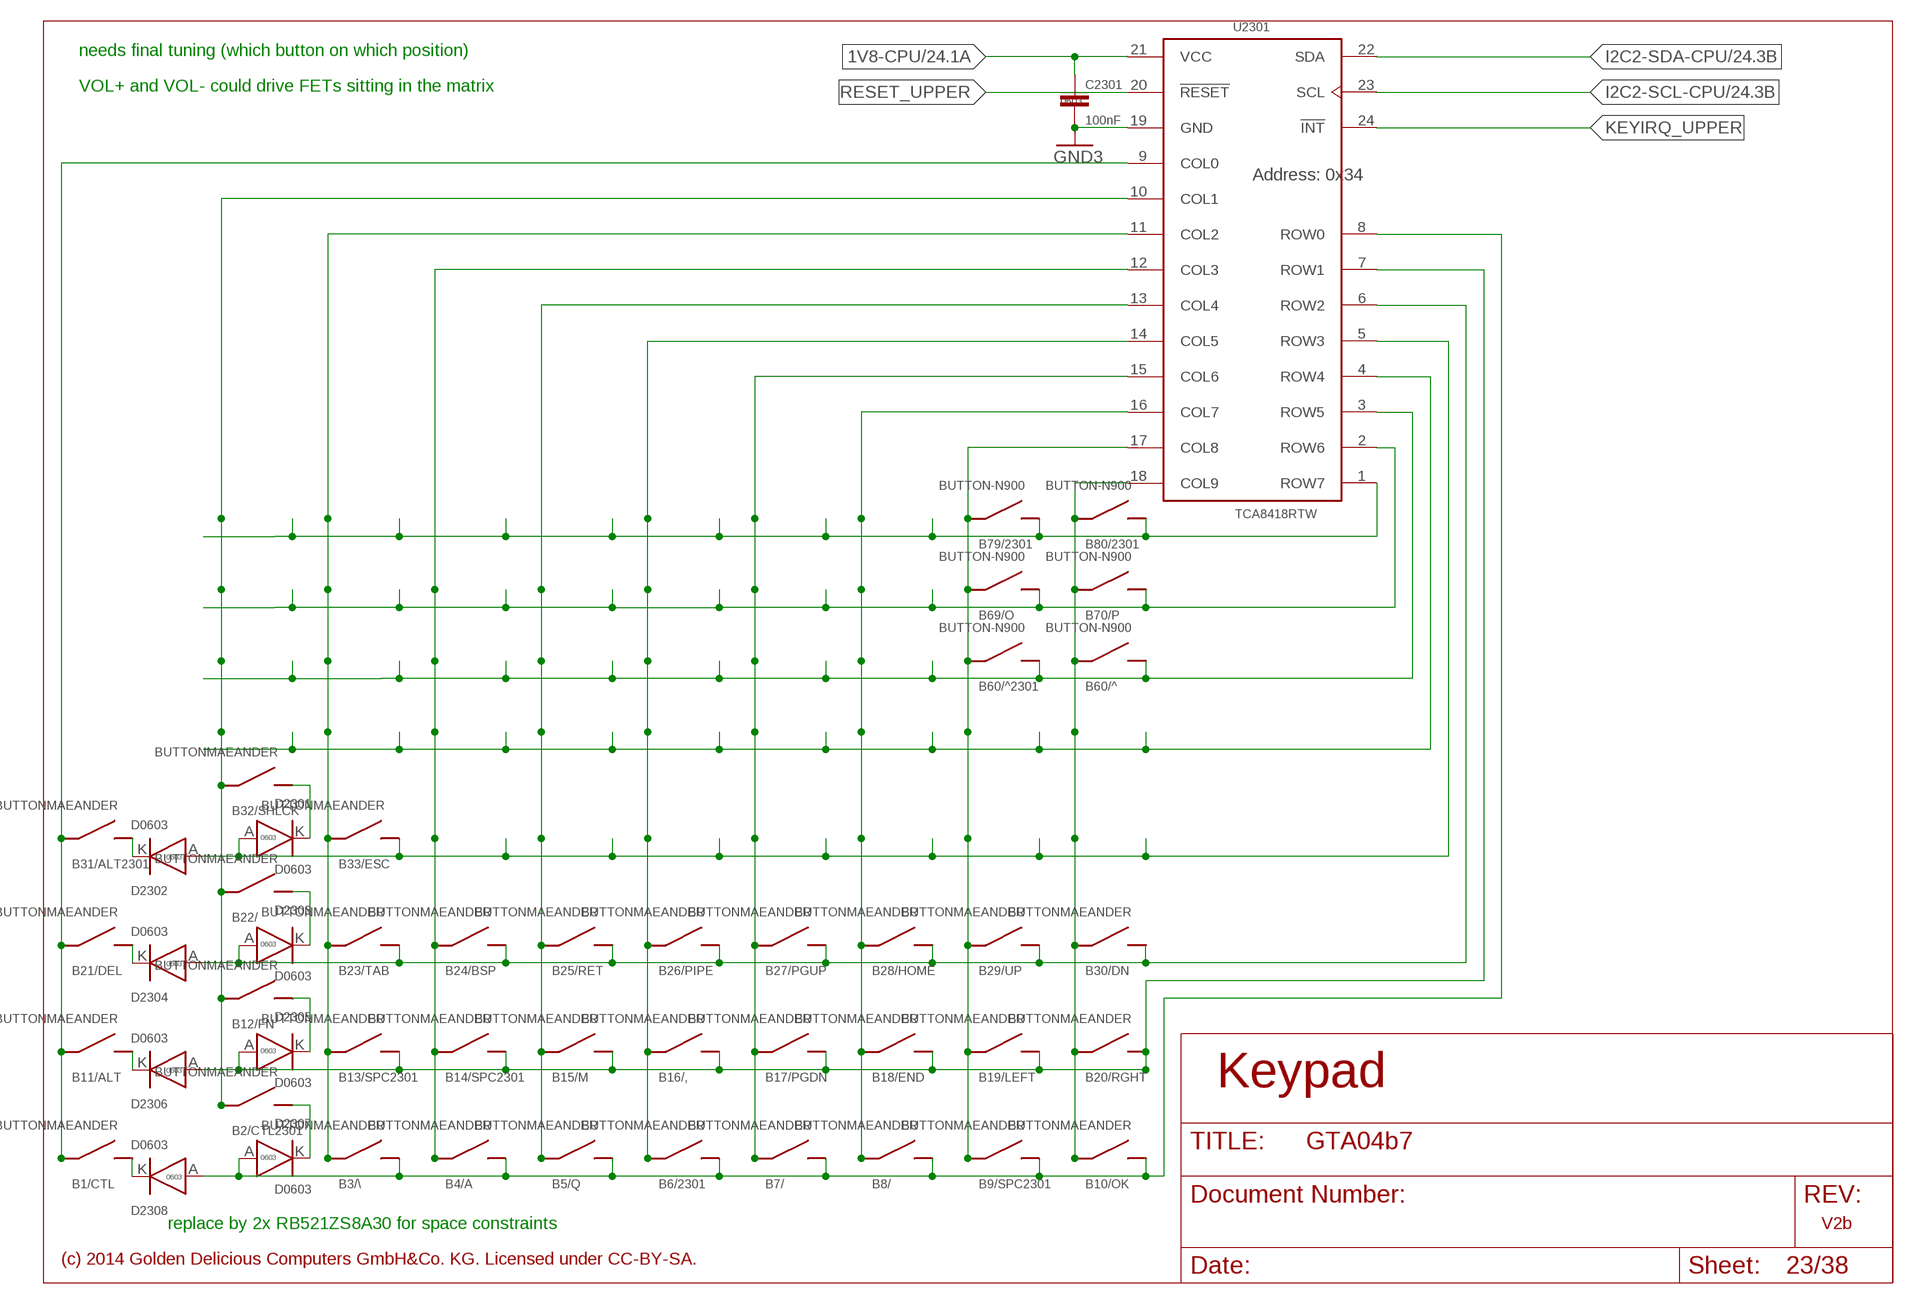
[diagram p26: schematic, sheet 23]

### Parts
B1/CTL  BUTTONMAEANDER  BUTTON-N900  [N900-BUTTON]  (not fitted in variant Full)  (not fitted in variant BB-XM)
B2/CTL2301  BUTTONMAEANDER  BUTTON-N900  [N900-BUTTON]  (not fitted in variant Full)  (not fitted in variant BB-XM)
B3/\\  BUTTONMAEANDER  BUTTON-N900  [N900-BUTTON]  (not fitted in variant Full)  (not fitted in variant BB-XM)
B4/A  BUTTONMAEANDER  BUTTON-N900  [N900-BUTTON]  (not fitted in variant Full)  (not fitted in variant BB-XM)
B5/Q  BUTTONMAEANDER  BUTTON-N900  [N900-BUTTON]  (not fitted in variant Full)  (not fitted in variant BB-XM)
B6/2301  BUTTONMAEANDER  BUTTON-N900  [N900-BUTTON]  (not fitted in variant Full)  (not fitted in variant BB-XM)
B7/  BUTTONMAEANDER  BUTTON-N900  [N900-BUTTON]  (not fitted in variant Full)  (not fitted in variant BB-XM)
B8/  BUTTONMAEANDER  BUTTON-N900  [N900-BUTTON]  (not fitted in variant Full)  (not fitted in variant BB-XM)
B9/SPC2301  BUTTONMAEANDER  BUTTON-N900  [N900-BUTTON]  (not fitted in variant Full)  (not fitted in variant BB-XM)
B10/OK  BUTTONMAEANDER  BUTTON-N900  [N900-BUTTON]  (not fitted in variant Full)  (not fitted in variant BB-XM)
B11/ALT  BUTTONMAEANDER  BUTTON-N900  [N900-BUTTON]  (not fitted in variant Full)  (not fitted in variant BB-XM)
B12/FN  BUTTONMAEANDER  BUTTON-N900  [N900-BUTTON]  (not fitted in variant Full)  (not fitted in variant BB-XM)
B13/SPC2301  BUTTONMAEANDER  BUTTON-N900  [N900-BUTTON]  (not fitted in variant Full)  (not fitted in variant BB-XM)
B14/SPC2301  BUTTONMAEANDER  BUTTON-N900  [N900-BUTTON]  (not fitted in variant Full)  (not fitted in variant BB-XM)
B15/M  BUTTONMAEANDER  BUTTON-N900  [N900-BUTTON]  (not fitted in variant Full)  (not fitted in variant BB-XM)
B16/,  BUTTONMAEANDER  BUTTON-N900  [N900-BUTTON]  (not fitted in variant Full)  (not fitted in variant BB-XM)
B17/PGDN  BUTTONMAEANDER  BUTTON-N900  [N900-BUTTON]  (not fitted in variant Full)  (not fitted in variant BB-XM)
B18/END  BUTTONMAEANDER  BUTTON-N900  [N900-BUTTON]  (not fitted in variant Full)  (not fitted in variant BB-XM)
B19/LEFT  BUTTONMAEANDER  BUTTON-N900  [N900-BUTTON]  (not fitted in variant Full)  (not fitted in variant BB-XM)
B20/RGHT  BUTTONMAEANDER  BUTTON-N900  [N900-BUTTON]  (not fitted in variant Full)  (not fitted in variant BB-XM)
B21/DEL  BUTTONMAEANDER  BUTTON-N900  [N900-BUTTON]  (not fitted in variant Full)  (not fitted in variant BB-XM)
B22/  BUTTONMAEANDER  BUTTON-N900  [N900-BUTTON]  (not fitted in variant Full)  (not fitted in variant BB-XM)
B23/TAB  BUTTONMAEANDER  BUTTON-N900  [N900-BUTTON]  (not fitted in variant Full)  (not fitted in variant BB-XM)
B24/BSP  BUTTONMAEANDER  BUTTON-N900  [N900-BUTTON]  (not fitted in variant Full)  (not fitted in variant BB-XM)
B25/RET  BUTTONMAEANDER  BUTTON-N900  [N900-BUTTON]  (not fitted in variant Full)  (not fitted in variant BB-XM)
B26/PIPE  BUTTONMAEANDER  BUTTON-N900  [N900-BUTTON]  (not fitted in variant Full)  (not fitted in variant BB-XM)
B27/PGUP  BUTTONMAEANDER  BUTTON-N900  [N900-BUTTON]  (not fitted in variant Full)  (not fitted in variant BB-XM)
B28/HOME  BUTTONMAEANDER  BUTTON-N900  [N900-BUTTON]  (not fitted in variant Full)  (not fitted in variant BB-XM)
B29/UP  BUTTONMAEANDER  BUTTON-N900  [N900-BUTTON]  (not fitted in variant Full)  (not fitted in variant BB-XM)
B30/DN  BUTTONMAEANDER  BUTTON-N900  [N900-BUTTON]  (not fitted in variant Full)  (not fitted in variant BB-XM)
B31/ALT2301  BUTTONMAEANDER  BUTTON-N900  [N900-BUTTON]  (not fitted in variant Full)  (not fitted in variant BB-XM)
B32/SHLCK  BUTTONMAEANDER  BUTTON-N900  [N900-BUTTON]  (not fitted in variant Full)  (not fitted in variant BB-XM)
B33/ESC  BUTTONMAEANDER  BUTTON-N900  [N900-BUTTON]  (not fitted in variant Full)  (not fitted in variant BB-XM)
B60/^  BUTTON-N900  [N900-BUTTON]  (not fitted in variant Full)  (not fitted in variant BB-XM)
B60/^2301  BUTTON-N900  [N900-BUTTON]  (not fitted in variant Full)  (not fitted in variant BB-XM)
B69/O  BUTTON-N900  [N900-BUTTON]  (not fitted in variant Full)  (not fitted in variant BB-XM)
B70/P  BUTTON-N900  [N900-BUTTON]  (not fitted in variant Full)  (not fitted in variant BB-XM)
B79/2301  BUTTON-N900  [N900-BUTTON]  (not fitted in variant Full)  (not fitted in variant BB-XM)
B80/2301  BUTTON-N900  [N900-BUTTON]  (not fitted in variant Full)  (not fitted in variant BB-XM)
C2301  100nF  C0603  [SMD-0603]
D2301  D0603  [SMD-0603D]
D2302  D0603  [SMD-0603D]
D2303  D0603  [SMD-0603D]
D2304  D0603  [SMD-0603D]
D2305  D0603  [SMD-0603D]
D2306  D0603  [SMD-0603D]
D2307  D0603  [SMD-0603D]
D2308  D0603  [SMD-0603D]
U2301  TCA8418RTW  [LPCC-24]

### Nets
1V8-CPU: C2301.1 U2301.21(VCC) ; also sheet 24,25,27,29,30,32
COL0_UPPER: B1/CTL.P$1(A) B11/ALT.P$1(A) B21/DEL.P$1(A) B31/ALT2301.P$1(A) U2301.9(COL0)
COL1_UPPER: B2/CTL2301.P$1(A) B12/FN.P$1(A) B22/.P$1(A) B32/SHLCK.P$1(A) U2301.10(COL1)
COL2_UPPER: B3/\\.P$1(A) B13/SPC2301.P$1(A) B23/TAB.P$1(A) B33/ESC.P$1(A) U2301.11(COL2)
COL3_UPPER: B4/A.P$1(A) B14/SPC2301.P$1(A) B24/BSP.P$1(A) U2301.12(COL3)
COL4_UPPER: B5/Q.P$1(A) B15/M.P$1(A) B25/RET.P$1(A) U2301.13(COL4)
COL5_UPPER: B6/2301.P$1(A) B16/,.P$1(A) B26/PIPE.P$1(A) U2301.14(COL5)
COL6_UPPER: B7/.P$1(A) B17/PGDN.P$1(A) B27/PGUP.P$1(A) U2301.15(COL6)
COL7_UPPER: B8/.P$1(A) B18/END.P$1(A) B28/HOME.P$1(A) U2301.16(COL7)
COL8_UPPER: B9/SPC2301.P$1(A) B19/LEFT.P$1(A) B29/UP.P$1(A) B60/^2301.P$1(A) B69/O.P$1(A) B79/2301.P$1(A) U2301.17(COL8)
COL9_UPPER: B10/OK.P$1(A) B20/RGHT.P$1(A) B30/DN.P$1(A) B60/^.P$1(A) B70/P.P$1(A) B80/2301.P$1(A) U2301.18(COL9)
GND3 [GND]: C2301.2 U2301.19(GND) ; supply symbol labelled GND-3 ; also sheet 22,24,25,27,28,29,30,31,32,33
I2C2-SCL-CPU: U2301.23(SCL) ; also sheet 24,25,26,33
I2C2-SDA-CPU: U2301.22(SDA) ; also sheet 24,25,26,33
KEYIRQ_UPPER: U2301.24(!INT)
N$1_UPPER: B1/CTL.P$2(B) D2308.K
N$2_UPPER: B11/ALT.P$2(B) D2306.K
N$3_UPPER: B21/DEL.P$2(B) D2304.K
N$4_UPPER: B31/ALT2301.P$2(B) D2302.K
N$9_UPPER: B2/CTL2301.P$2(B) D2307.K
N$10_UPPER: B12/FN.P$2(B) D2305.K
N$11_UPPER: B22/.P$2(B) D2303.K
N$12_UPPER: B32/SHLCK.P$2(B) D2301.K
RESET_UPPER: U2301.20(!RESET)
ROW0_UPPER: B3/\\.P$2(B) B4/A.P$2(B) B5/Q.P$2(B) B6/2301.P$2(B) B7/.P$2(B) B8/.P$2(B) B9/SPC2301.P$2(B) B10/OK.P$2(B) D2307.A D2308.A U2301.8(ROW0)
ROW1_UPPER: B13/SPC2301.P$2(B) B14/SPC2301.P$2(B) B15/M.P$2(B) B16/,.P$2(B) B17/PGDN.P$2(B) B18/END.P$2(B) B19/LEFT.P$2(B) B20/RGHT.P$2(B) D2305.A D2306.A U2301.7(ROW1)
ROW2_UPPER: B23/TAB.P$2(B) B24/BSP.P$2(B) B25/RET.P$2(B) B26/PIPE.P$2(B) B27/PGUP.P$2(B) B28/HOME.P$2(B) B29/UP.P$2(B) B30/DN.P$2(B) D2303.A D2304.A U2301.6(ROW2)
ROW3_UPPER: B33/ESC.P$2(B) D2301.A D2302.A U2301.5(ROW3)
ROW4_UPPER: U2301.4(ROW4)
ROW5_UPPER: B60/^2301.P$2(B) B60/^.P$2(B) U2301.3(ROW5)
ROW6_UPPER: B69/O.P$2(B) B70/P.P$2(B) U2301.2(ROW6)
ROW7_UPPER: B79/2301.P$2(B) B80/2301.P$2(B) U2301.1(ROW7)

### Notes on the sheet
- needs final tuning (which button on which position)
- VOL+ and VOL- could drive FETs sitting in the matrix
- Address: 0x34
- Keypad
- replace by 2x RB521ZS8A30 for space constraints | V2b
- (c) 2014 Golden Delicious Computers GmbH&Co. KG. Licensed under CC-BY-SA.

## Sheet 24 of 38
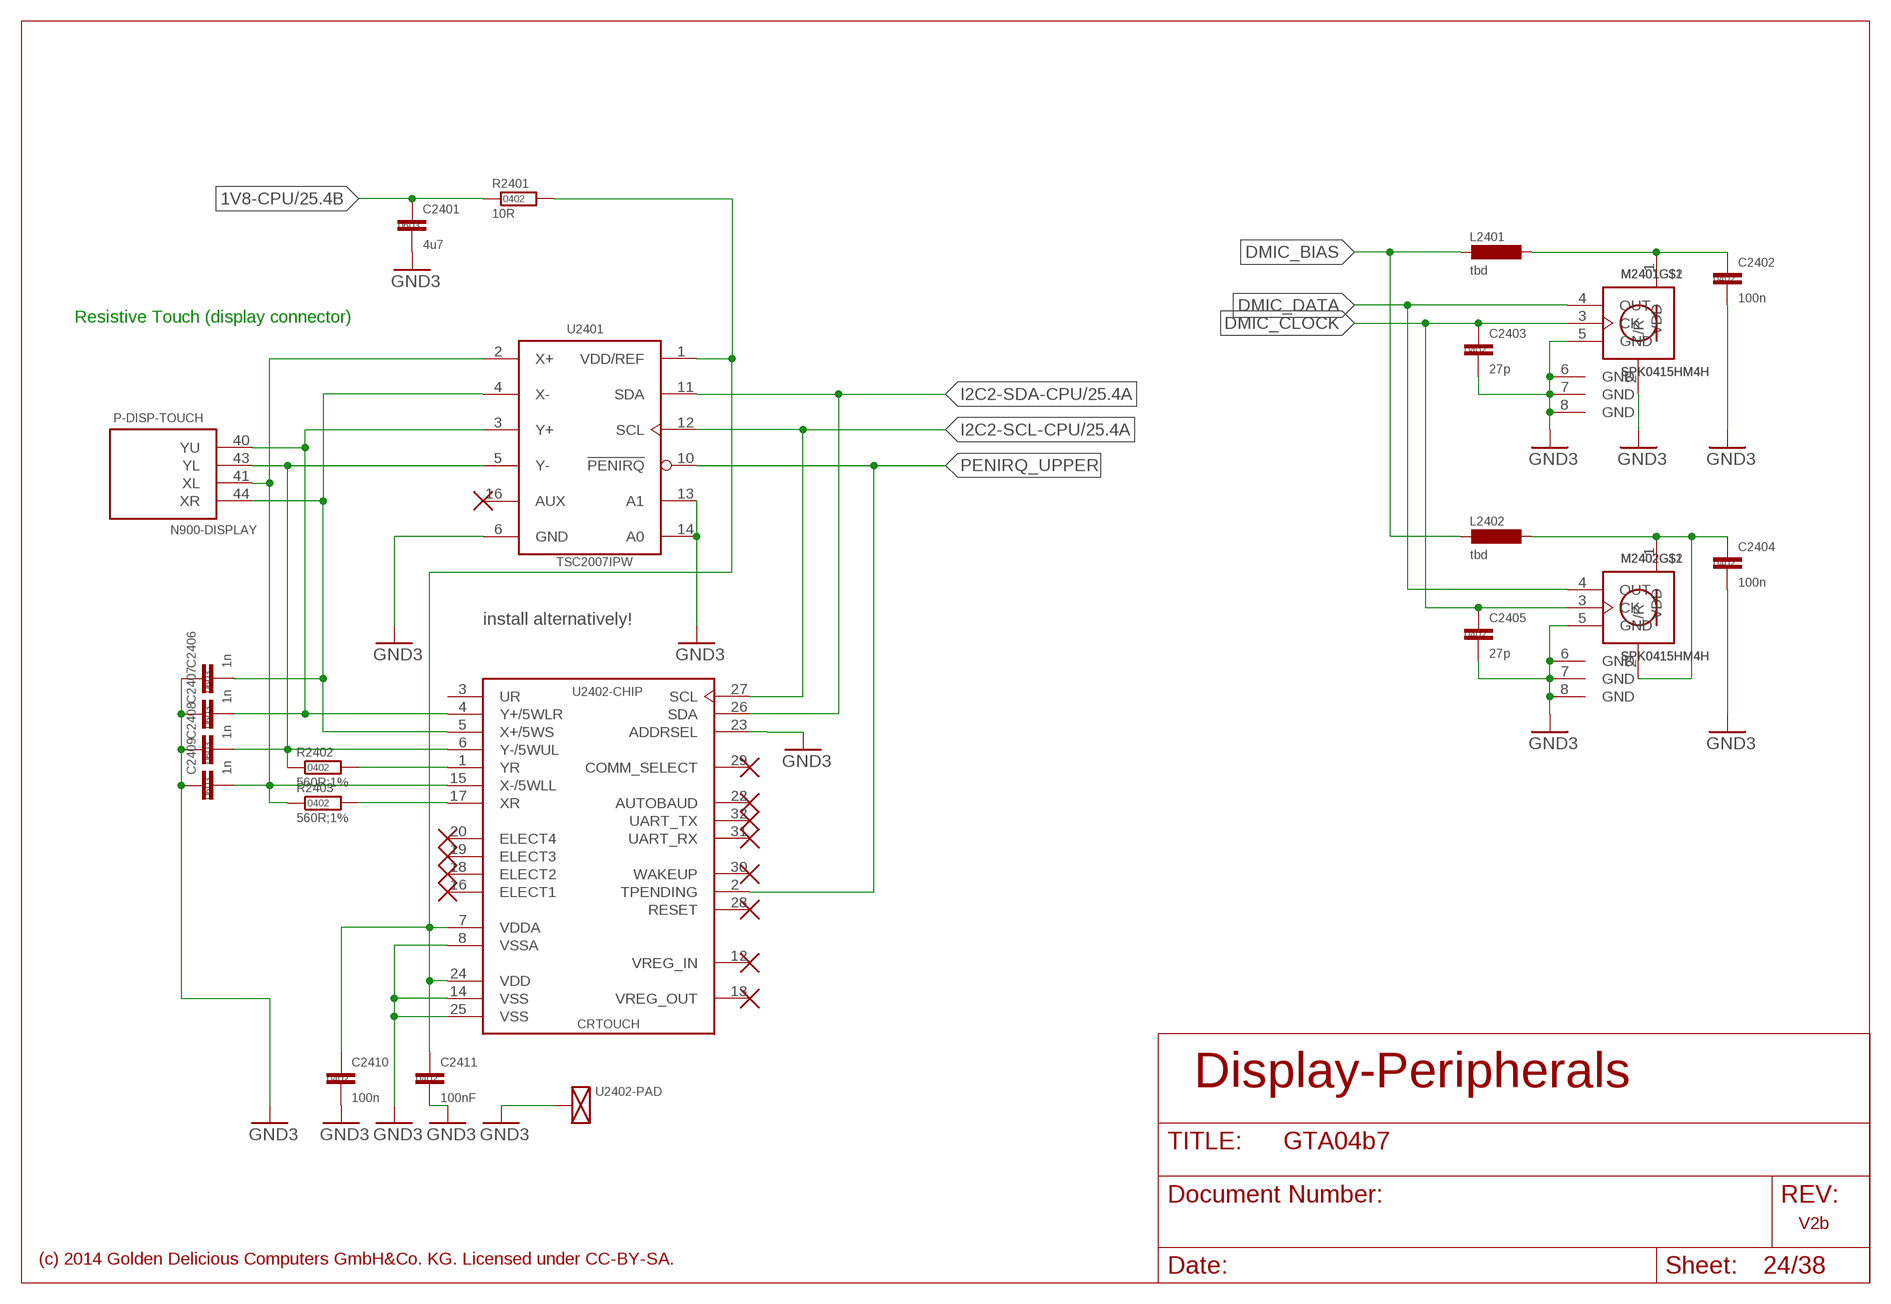
[diagram p27: schematic, sheet 24]

### Parts
C2401  4u7  C0603  [SMD-0603]
C2402  100n  C0402  [SMD-0402]
C2403  27p  C0402  [SMD-0402]
C2404  100n  C0402  [SMD-0402]
C2405  27p  C0402  [SMD-0402]
C2406  1n  C0603  [SMD-0603]
C2407  1n  C0603  [SMD-0603]
C2408  1n  C0603  [SMD-0603]
C2409  1n  C0603  [SMD-0603]
C2410  100n  C0402  [SMD-0402]
C2411  100nF  C0402  [SMD-0402]
L2401  tbd  L-MPZ1608  [MPZ1608]
L2402  tbd  L-MPZ1608  [MPZ1608]
M2401  SPK0415HM4H  [SPK0415HM4H-B]
M2402  SPK0415HM4H  [SPK0415HM4H-B]
P-DISP  N900-DISPLAY  [500024-6471]
R2401  10R  R0402  [SMD-0402]
R2402  560R;1%  R0402  [SMD-0402]
R2403  560R;1%  R0402  [SMD-0402]
U2401  TSC2007IPW  [TSSOP16]
U2402  CRTOUCH  [QFN-32+E-0.5]

### Nets
1V8-CPU: C2401.1 R2401.1 ; also sheet 23,25,27,29,30,32
DMIC_BIAS: L2401.2 L2402.2
DMIC_CLOCK: C2403.1 C2405.1
DMIC_DATA: M2401.4(OUT) M2402.4(OUT)
GND3 [GND]: C2401.2 C2402.2 C2403.2 C2404.2 C2405.2 C2406.1 C2407.1 C2408.1 C2409.1 C2410.2 C2411.2 M2401.2(L/R) M2401.5(GND) M2401.6(GND1:GND) M2401.7(GND2:GND) M2401.8(GND3:GND) M2402.5(GND) M2402.6(GND1:GND) M2402.7(GND2:GND) M2402.8(GND3:GND) U2401.6(GND) U2401.13(A1) U2401.14(A0) U2402.8(-CHIP:VSSA) U2402.14(-CHIP:VSS) U2402.23(-CHIP:ADDRSEL) U2402.25(-CHIP:VSS) U2402.EXP(-PAD:SHIELD) ; supply symbol labelled GND-3 ; also sheet 22,23,25,27,28,29,30,31,32,33
I2C2-SCL-CPU: U2401.12(SCL) U2402.27(-CHIP:SCL) ; also sheet 23,25,26,33
I2C2-SDA-CPU: U2401.11(SDA) U2402.26(-CHIP:SDA) ; also sheet 23,25,26,33
N$24_UPPER: C2407.2 P-DISP.40(-TOUCH:YU) U2401.3(Y+) U2402.4(-CHIP:Y+/5WLR)
N$25_UPPER: C2408.2 P-DISP.43(-TOUCH:YL) R2402.1 U2401.5(Y-) U2402.6(-CHIP:Y-/5WUL)
N$26_UPPER: C2406.2 P-DISP.44(-TOUCH:XR) U2401.4(X-) U2402.5(-CHIP:X+/5WS)
N$27_UPPER: C2409.2 P-DISP.41(-TOUCH:XL) R2403.1 U2401.2(X+) U2402.15(-CHIP:X-/5WLL)
N$35_UPPER: C2410.1 C2411.1 R2401.2 U2401.1(VDD/REF) U2402.7(-CHIP:VDDA) U2402.24(-CHIP:VDD)
N$36_UPPER: R2402.2 U2402.1(-CHIP:YR)
N$37_UPPER: R2403.2 U2402.17(-CHIP:XR)
N$124: C2402.1 L2401.1 M2401.1(VDD)
N$200: C2404.1 L2402.1 M2402.1(VDD) M2402.2(L/R)
PENIRQ_UPPER: U2401.10(!PENIRQ) U2402.2(-CHIP:TPENDING)
Unconnected: M2401.3(CK) M2402.3(CK) U2401.16(AUX) U2402.3(-CHIP:UR) U2402.16(-CHIP:ELECT1) U2402.18(-CHIP:ELECT2) U2402.19(-CHIP:ELECT3) U2402.20(-CHIP:ELECT4) U2402.22(-CHIP:AUTOBAUD) U2402.28(-CHIP:RESET) U2402.29(-CHIP:COMM_SELECT) U2402.30(-CHIP:WAKEUP) U2402.31(-CHIP:UART_RX) U2402.32(-CHIP:UART_TX)

### Notes on the sheet
- Resistive Touch (display connector)
- install alternatively!
- Display-Peripherals
- V2b
- (c) 2014 Golden Delicious Computers GmbH&Co. KG. Licensed under CC-BY-SA.

## Sheet 25 of 38
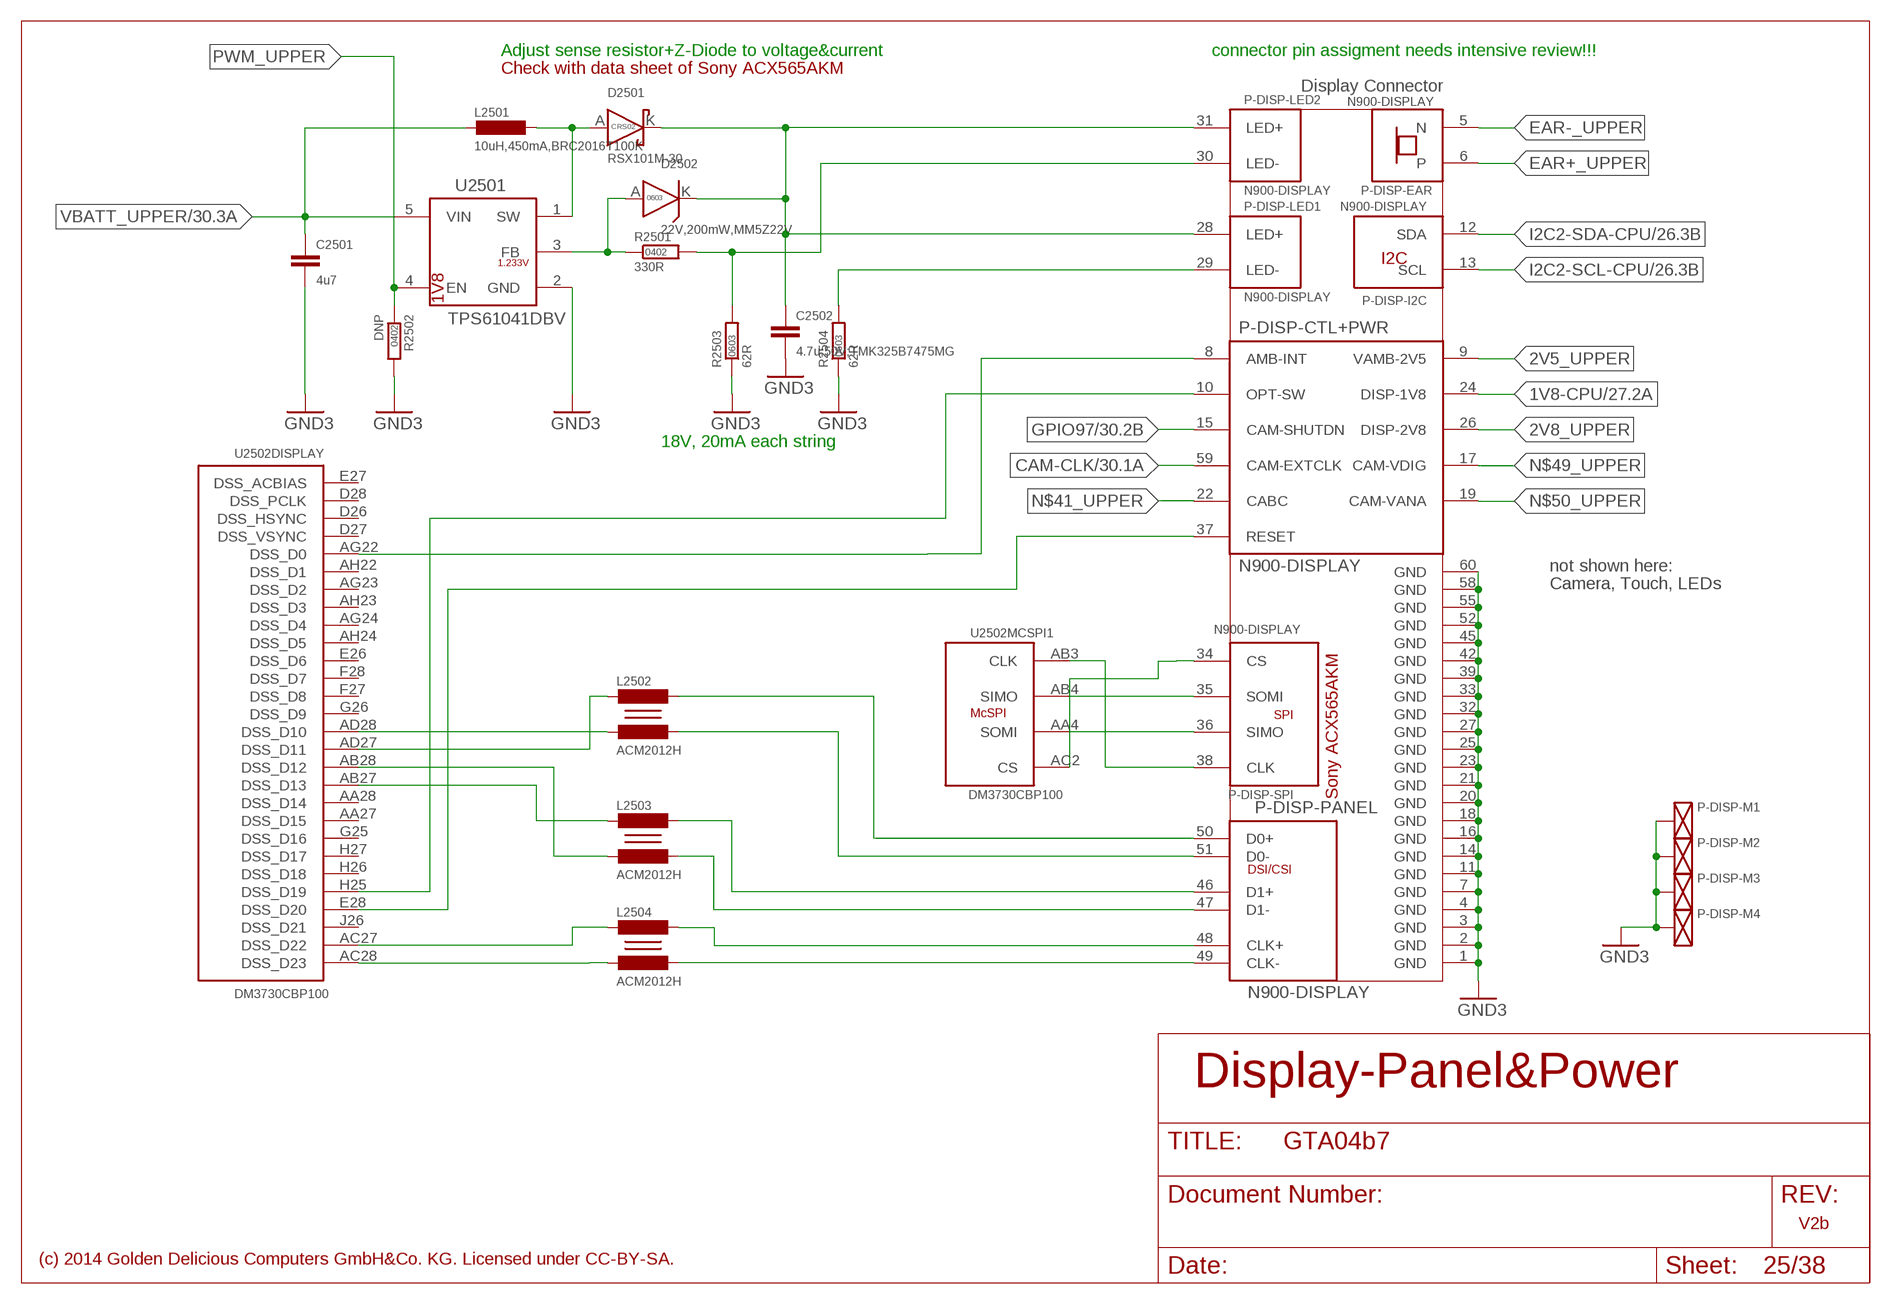
[diagram p28: schematic, sheet 25]

### Parts
C2501  4u7  C-MK325  [MK325]
C2502  4.7u;50V;TMK325B7475MG  C-MK325  [MK325]
D2501  RSX101M-30  D-SCHOTTKY-CRS02  [CRS02]
D2502  22V,200mW,MM5Z22V  D-ZENER0603  [SMD-0603D]
L2501  10uH,450mA,BRC2016T100K  L-LB2016  [LB2016]
L2502  ACM2012H  COMMON-MODE-FILTERACM2012H  [ACM2012H]
L2503  ACM2012H  COMMON-MODE-FILTERACM2012H  [ACM2012H]
L2504  ACM2012H  COMMON-MODE-FILTERACM2012H  [ACM2012H]
R2501  330R  R0402  [SMD-0402]
R2502  DNP  R0402  [SMD-0402]
R2503  62R  R0603  [SMD-0603]
R2504  62R  R0603  [SMD-0603]
U2501  TPS61041DBV  [SOT23-5]
U2502  DM3730CBP100  OMAP3530DCBB  [PBGA784-N515-0.4]

### Nets
1V8-CPU: P-DISP.24(-CTL+PWR:DISP-1V8) ; also sheet 23,24,27,29,30,32
2V5_UPPER: P-DISP.9(-CTL+PWR:VAMB-2V5)
2V8_UPPER: P-DISP.26(-CTL+PWR:DISP-2V8)
CAM-CLK: P-DISP.59(-CTL+PWR:CAM-EXTCLK) ; also sheet 30
CDP-CLK+_UPPER: L2504.1(A1) U2502.AC27(DISPLAY:DSS_D22)
CDP-CLK-_UPPER: L2504.2(B1) U2502.AC28(DISPLAY:DSS_D23)
CDP-D0+_UPPER: L2502.1(A1) U2502.AD27(DISPLAY:DSS_D11)
CDP-D0-_UPPER: L2502.2(B1) U2502.AD28(DISPLAY:DSS_D10)
CDP-D1+_UPPER: L2503.1(A1) U2502.AB27(DISPLAY:DSS_D13)
CDP-D1-_UPPER: L2503.2(B1) U2502.AB28(DISPLAY:DSS_D12)
EAR+_UPPER: P-DISP.6(-EAR:P)
EAR-_UPPER: P-DISP.5(-EAR:N)
GND3 [GND]: C2501.2 C2502.2 P-DISP.1(GND) P-DISP.2(GND) P-DISP.3(GND) P-DISP.4(GND) P-DISP.7(GND) P-DISP.11(GND) P-DISP.14(GND) P-DISP.16(GND) P-DISP.18(GND) P-DISP.20(GND) P-DISP.21(GND) P-DISP.23(GND) P-DISP.25(GND) P-DISP.27(GND) P-DISP.32(GND) P-DISP.33(GND) P-DISP.39(GND) P-DISP.42(GND) P-DISP.45(GND) P-DISP.52(GND) P-DISP.55(GND) P-DISP.58(GND) P-DISP.60(GND) P-DISP.M1(-M1:SHIELD) P-DISP.M2(-M2:SHIELD) P-DISP.M3(-M3:SHIELD) P-DISP.M4(-M4:SHIELD) R2502.2 R2503.1 R2504.1 U2501.2(GND) ; supply symbol labelled GND-3 ; also sheet 22,23,24,27,28,29,30,31,32,33
GPIO97: P-DISP.15(-CTL+PWR:CAM-SHUTDN) ; also sheet 30
I2C2-SCL-CPU: P-DISP.13(-I2C:SCL) ; also sheet 23,24,26,33
I2C2-SDA-CPU: P-DISP.12(-I2C:SDA) ; also sheet 23,24,26,33
N$13_UPPER: L2504.3(B2) P-DISP.49(-PANEL:CLK-)
N$23_UPPER: L2504.4(A2) P-DISP.48(-PANEL:CLK+)
N$29_UPPER: L2503.3(B2) P-DISP.47(-PANEL:D1-)
N$30_UPPER: L2503.4(A2) P-DISP.46(-PANEL:D1+)
N$31_UPPER: L2502.3(B2) P-DISP.51(-PANEL:D0-)
N$32_UPPER: L2502.4(A2) P-DISP.50(-PANEL:D0+)
N$33_UPPER: P-DISP.38(-SPI:CLK) U2502.AB3(MCSPI1:CLK)
N$34_UPPER: P-DISP.36(-SPI:SIMO) U2502.AA4(MCSPI1:SOMI)
N$38_UPPER: P-DISP.35(-SPI:SOMI) U2502.AB4(MCSPI1:SIMO)
N$39_UPPER: P-DISP.34(-SPI:CS) U2502.AC2(MCSPI1:CS)
N$40_UPPER: P-DISP.37(-CTL+PWR:RESET) U2502.E28(DISPLAY:DSS_D20)
N$41_UPPER: P-DISP.22(-CTL+PWR:CABC)
N$44_UPPER: P-DISP.10(-CTL+PWR:OPT-SW) U2502.H25(DISPLAY:DSS_D19)
N$45_UPPER: P-DISP.8(-CTL+PWR:AMB-INT) U2502.AG22(DISPLAY:DSS_D0)
N$49_UPPER: P-DISP.17(-CTL+PWR:CAM-VDIG)
N$50_UPPER: P-DISP.19(-CTL+PWR:CAM-VANA)
N$101_UPPER: D2502.A R2501.1 U2501.3(FB)
N$102_UPPER: P-DISP.29(-LED1:LED-) R2504.2
N$310_UPPER: D2501.A L2501.1 U2501.1(SW)
N$311_UPPER: C2502.1 D2501.K D2502.K P-DISP.28(-LED1:LED+) P-DISP.31(-LED2:LED+)
N$313_UPPER: P-DISP.30(-LED2:LED-) R2501.2 R2503.2
PWM_UPPER: R2502.1 U2501.4(EN)
VBATT_UPPER [Battery]: C2501.1 L2501.2 U2501.5(VIN) ; also sheet 22,30
Unconnected: U2502.A1(SYS:SYS_OPMCSWS) U2502.A4(SDRC:SDRC_A0) U2502.A6(SDRC:SDRC_DQS0) U2502.A7(SDRC:SDRC_D5) U2502.A9(SDRC:SDRC_D7) U2502.A10(SDRC:SDRC_DQS2) U2502.A11(SDRC:SDRC_D21) U2502.A13(SDRC:SDRC_CLK) U2502.A14(SDRC:SDRC_NCLK) U2502.A16(SDRC:SDRC_DM1) U2502.A17(SDRC:SDRC_DQS1) U2502.A19(SDRC:SDRC_D25) U2502.A20(SDRC:SDRC_DQS3) U2502.A21(SDRC:SDRC_D29) U2502.AA3(HSUSB2:D7) U2502.AA8(UART1:TX) U2502.AA9(UART1:RTS) U2502.AA10(JTAG:JTAG_EMU1) U2502.AA11(JTAG:JTAG_EMU0) U2502.AA12(JTAG:JTAG_RTCK) U2502.AA13(JTAG:JTAG_TCK) U2502.AA17(JTAG:JTAG_NTRST) U2502.AA18(JTAG:JTAG_TMS_TSMC) U2502.AA19(JTAG:JTAG_TDO) U2502.AA20(JTAG:JTAG_TDI) U2502.AA21(GPIO157/1FSR:GPIO) U2502.AA25(UART2:TX) U2502.AA27(DISPLAY:DSS_D15) U2502.AA28(DISPLAY:DSS_D14) U2502.AB1(MMC3:CLK) U2502.AB2(HSUSB2:D2) U2502.AB25(UART2:RTS) U2502.AB26(UART2:CTS) U2502.AC1(MCBSP4:FSX) U2502.AC3(MMC3:CMD) U2502.AD1(MCBSP4:DR) U2502.AD2(MCBSP4:DX) U2502.AD25(UART2:RX) U2502.AD26(I2C4:SCL) U2502.AE1(MCBSP4:CLKX) U2502.AE3(MMC3:DAT3) U2502.AE4(MMC3:DAT0) U2502.AE5(MCBSP3:FSX) U2502.AE6(MCBSP3:DR) U2502.AE7(HSUSB2:CLK) U2502.AE10(GPIO13:GPIO) U2502.AE11(MCBSP5:DR) U2502.AE13(MCSPI3:CLK) U2502.AE17(CLOCK:SYS_XTALIN) U2502.AE22(CLOCK:SYS_CLKOUT2/GPIO186) U2502.AE25(CLOCK:SYS_32K) U2502.AE26(I2C4:SDA) U2502.AF3(MMC3:DAT2) U2502.AF5(MCBSP3:CLKX) U2502.AF6(MCBSP3:DX) U2502.AF7(HSUSB2:STP) U2502.AF9(SYS:SYS_DRM_MSECURE/GPIO22) U2502.AF10(MCBSP5:CLKX) U2502.AF11(MCSPI3:SIMO) U2502.AF13(MCBSP5:DX) U2502.AF17(CLOCK:SYS_XTALOUT) U2502.AF22(SYS:SYS_OFF_MODE/GPIO9) U2502.AF25(CLOCK:SYS_CLKREQ) U2502.AG7(HSUSB2:DIR) U2502.AG8(HSUSB2:D0) U2502.AG9(SYS:SYS_SECURE_INDICATOR/GPIO23) U2502.AG11(SYS:POP_INT0_FT) U2502.AG12(MCSPI3:SOMI) U2502.AG13(SYS:POP_RESET_RP_FT) U2502.AG18(GPIN114:GPIN) U2502.AG19(GPIN112:GPIN) U2502.AG23(DISPLAY:DSS_D2) U2502.AG24(DISPLAY:DSS_D4) U2502.AG25(CLOCK:SYS_CLKOUT1/GPIO10) U2502.AH3(MMC3:DAT1) U2502.AH7(HSUSB2:NXT) U2502.AH8(HSUSB2:D1) U2502.AH9(MCBSP5:FSX) U2502.AH11(SYS:POP_INT1_FT) U2502.AH12(MCSPI3:CS) U2502.AH14(GPIO21:GPIO) U2502.AH16(SYS:POP_TQ_TEMP_SENSE_FT) U2502.AH18(GPIN115:GPIN) U2502.AH19(GPIN113:GPIN) U2502.AH22(DISPLAY:DSS_D1) U2502.AH23(DISPLAY:DSS_D3) U2502.AH24(DISPLAY:DSS_D5) U2502.B1(SYS:SYS_IPMCSWS) U2502.B3(SDRC:SDRC_A2) U2502.B4(SDRC:SDRC_A1) U2502.B6(SDRC:SDRC_D2) U2502.B7(SDRC:SDRC_DM0) U2502.B9(SDRC:SDRC_D6) U2502.B10(SDRC:SDRC_D17) U2502.B11(SDRC:SDRC_DM2) U2502.B13(SDRC:SDRC_D22) U2502.B14(SDRC:SDRC_D9) U2502.B16(SDRC:SDRC_D11) U2502.B17(SDRC:SDRC_D14) U2502.B19(SDRC:SDRC_D26) U2502.B20(SDRC:SDRC_D27) U2502.B21(SDRC:SDRC_D30) U2502.C1(SDRC:SDRC_A8) U2502.C2(SDRC:SDRC_A7) U2502.C3(SDRC:SDRC_A6) U2502.C4(SDRC:SDRC_A4) U2502.C5(SDRC:SDRC_A3) U2502.C6(SDRC:SDRC_D1) U2502.C8(SDRC:SDRC_D3) U2502.C9(SDRC:SDRC_D4) U2502.C11(SDRC:SDRC_D18) U2502.C12(SDRC:SDRC_D20) U2502.C14(SDRC:SDRC_D8) U2502.C15(SDRC:SDRC_D10) U2502.C17(SDRC:SDRC_D13) U2502.C18(SDRC:SDRC_D24) U2502.C20(SDRC:SDRC_DM3) U2502.C21(SDRC:SDRC_D31) U2502.D1(SDRC:SDRC_A12) U2502.D2(SDRC:SDRC_A11) U2502.D3(SDRC:SDRC_A10) U2502.D4(SDRC:SDRC_A9) U2502.D5(SDRC:SDRC_A5) U2502.D6(SDRC:SDRC_D0) U2502.D11(SDRC:SDRC_D16) U2502.D12(SDRC:SDRC_D19) U2502.D14(SDRC:SDRC_D23) U2502.D17(SDRC:SDRC_D12) U2502.D18(SDRC:SDRC_D15) U2502.D20(SDRC:SDRC_D28) U2502.D26(DISPLAY:DSS_HSYNC) U2502.D27(DISPLAY:DSS_VSYNC) U2502.D28(DISPLAY:DSS_PCLK) U2502.E1(SDRC:SDRC_A14) U2502.E2(SDRC:SDRC_A13) U2502.E26(DISPLAY:DSS_D6) U2502.E27(DISPLAY:DSS_ACBIAS) U2502.F3(GMPC:GMPC_NADV_ALE) U2502.F4(GMPC:GMPC_NWE) U2502.F27(DISPLAY:DSS_D8) U2502.F28(DISPLAY:DSS_D7) U2502.G1(POWER:VPP) U2502.G2(GMPC:GMPC_NOE) U2502.G3(GMPC:GMPC_NBE0_CLE) U2502.G4(GMPC:GMPC_NCS0) U2502.G25(DISPLAY:DSS_D16) U2502.G26(DISPLAY:DSS_D9) U2502.H1(GMPC:GMPC_NWP) U2502.H2(GMPC:GMPC_D8) U2502.H3(GMPC:GMPC_NCS1) U2502.H9(SDRC:SDRC_BA0) U2502.H10(SDRC:SDRC_BA1) U2502.H11(SDRC:SDRC_NCS0) U2502.H12(SDRC:SDRC_NCS1) U2502.H13(SDRC:SDRC_NCAS) U2502.H14(SDRC:SDRC_NRAS) U2502.H15(SDRC:SDRC_NWE) U2502.H16(SDRC:SDRC_CKE0) U2502.H17(SDRC:SDRC_CKE1) U2502.H18(UART3:CTS) U2502.H19(UART3:RTS) U2502.H20(UART3:RX) U2502.H21(UART3:TX) U2502.H26(DISPLAY:DSS_D18) U2502.H27(DISPLAY:DSS_D17) U2502.J8(GMPC-MISC:GMPC_WAIT3/GPIO_65) U2502.J21(I2C1:SDA) U2502.J25(HDQ:HDQ) U2502.J26(DISPLAY:DSS_D21) U2502.K1(GMPC:GMPC_D0) U2502.K2(GMPC:GMPC_D9) U2502.K3(GMPC:GMPC_A10) U2502.K4(GMPC:GMPC_A4) U2502.K8(GMPC-MISC:GMPC_WAIT2/GPIO_64) U2502.K21(I2C1:SCL) U2502.K26(MCBSP1:FSX) U2502.L1(GMPC:GMPC_D1) U2502.L2(GMPC:GMPC_D2) U2502.L3(GMPC:GMPC_A9) U2502.L4(GMPC:GMPC_A3) U2502.L8(GMPC:GMPC_NWAIT1) U2502.M3(GMPC:GMPC_A8) U2502.M4(GMPC:GMPC_A2) U2502.M8(GMPC:GMPC_NWAIT0) U2502.M21(MCBSP2:DX) U2502.N3(GMPC:GMPC_A7) U2502.N4(GMPC:GMPC_A1) U2502.N8(GMPC-MISC:GMPC_NCS7/GPIO_58) U2502.N21(MCBSP2:CLKX) U2502.P1(GMPC:GMPC_D10) U2502.P2(GMPC:GMPC_D3) U2502.P8(SYS:SYS_NDMAREQ3/GPIO57) U2502.P21(MCBSP2:FSX) U2502.R1(GMPC:GMPC_D11) U2502.R2(GMPC:GMPC_D12) U2502.R3(GMPC:GMPC_A6) U2502.R8(SYS:SYS_NDMAREQ2/GPIO56) U2502.R21(MCBSP2:DR) U2502.R28(HSUSB0:DIR) U2502.T1(GMPC:GMPC_D4) U2502.T2(GMPC:GMPC_D13) U2502.T3(GMPC:GMPC_A5) U2502.T4(GMPC:GMPC_CLK) U2502.T8(SYS:SYS_NDMAREQ1/GPIO55) U2502.T21(GPIO160:GPIO) U2502.T25(HSUSB0:STP) U2502.T26(HSUSB0:NXT) U2502.T27(HSUSB0:D0) U2502.T28(HSUSB0:CLK) U2502.U3(GMPC-MISC:GMPC_NBE1/GPIO_61) U2502.U4(POWER:BG_TESTOUT) U2502.U8(SYS:SYS_NDMAREQ0/GPIO54) U2502.U21(MCBSP1:DR) U2502.U25(HSUSB0:D4) U2502.U26(HSUSB0:D3) U2502.U27(HSUSB0:D2) U2502.U28(HSUSB0:D1) U2502.V1(GMPC:GMPC_D5) U2502.V2(GMPC:GMPC_D6) U2502.V3(HSUSB2:D3) U2502.V8(GMPC-MISC:GMPC_NCS2/GPIO_53) U2502.V21(MCBSP1:DX) U2502.V26(HSUSB0:D7) U2502.V27(HSUSB0:D6) U2502.V28(HSUSB0:D5) U2502.W1(GMPC:GMPC_D14) U2502.W2(GMPC:GMPC_D7) U2502.W8(UART1:CTS) U2502.W21(MCBSP1:CLKX) U2502.W26(TV:TV_VREF) U2502.W27(TV:TV_VFB2) U2502.W28(TV:TV_OUT2) U2502.Y1(GMPC:GMPC_D15) U2502.Y2(HSUSB2:D4) U2502.Y3(HSUSB2:D5) U2502.Y4(HSUSB2:D6) U2502.Y8(UART1:RX) U2502.Y21(GPIO156/1CLKR:GPIO) U2502.Y27(TV:TV_VFB1) U2502.Y28(TV:TV_OUT1)

### Notes on the sheet
- Adjust sense resistor+Z-Diode to voltage&current | connector pin assigment needs intensive review!!!
- Check with data sheet of Sony ACX565AKM
- Display Connector
- 18V, 20mA each string
- not shown here:
- Camera, Touch, LEDs
- Sony ACX565AKM
- Display-Panel&Power
- V2b
- (c) 2014 Golden Delicious Computers GmbH&Co. KG. Licensed under CC-BY-SA.

## Sheet 26 of 38
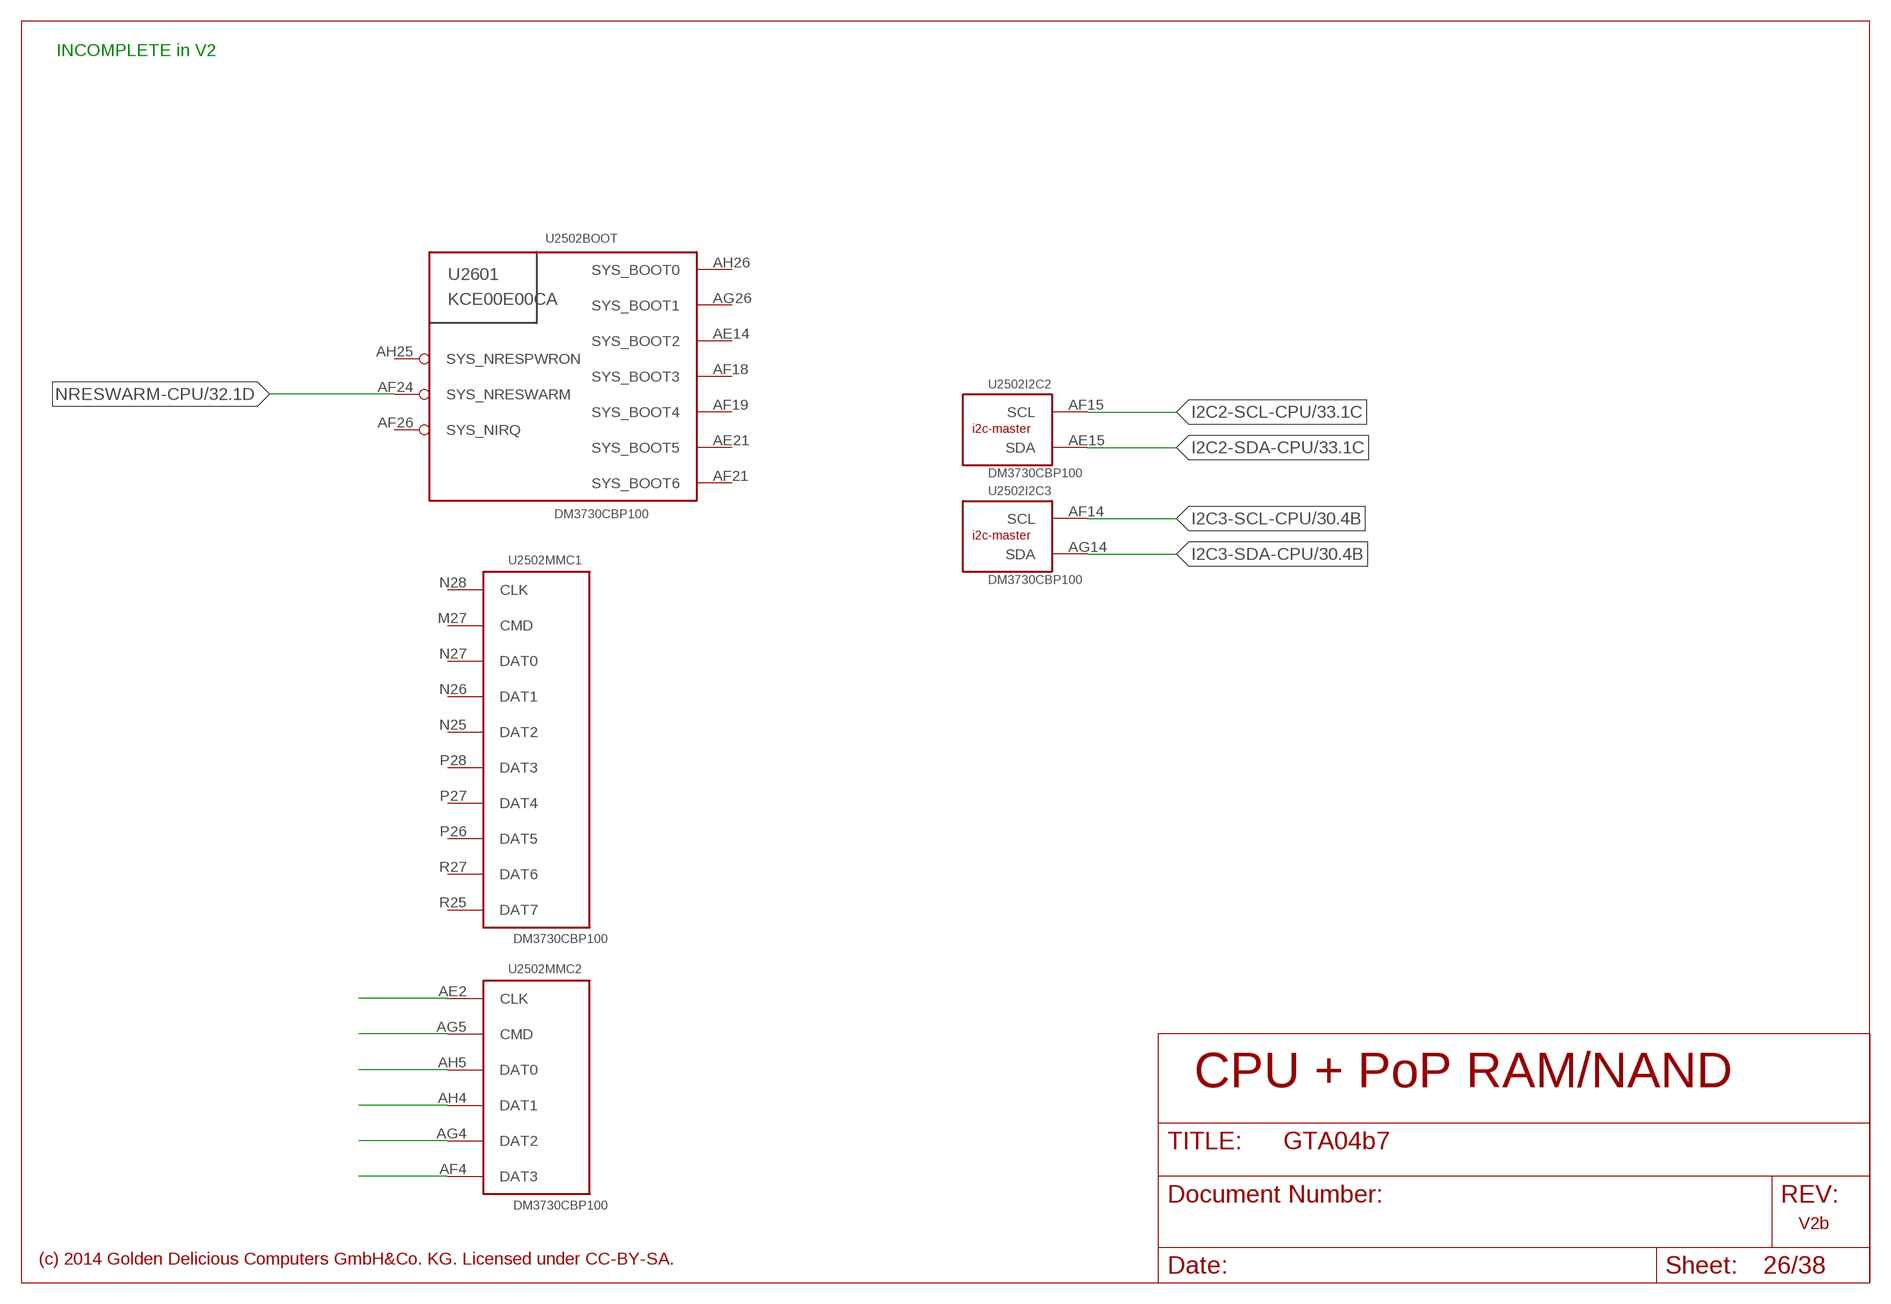
[diagram p29: schematic, sheet 26]

### Parts
U2601  KCE00E00CA  MECHANICAL  [NONE]

### Nets
I2C2-SCL-CPU: U2502.AF15(I2C2:SCL) ; also sheet 23,24,25,33
I2C2-SDA-CPU: U2502.AE15(I2C2:SDA) ; also sheet 23,24,25,33
I2C3-SCL-CPU: U2502.AF14(I2C3:SCL) ; also sheet 30,31,32,33
I2C3-SDA-CPU: U2502.AG14(I2C3:SDA) ; also sheet 30,31,32,33
N$208: U2502.AE2(MMC2:CLK)
N$211: U2502.AG5(MMC2:CMD)
N$212: U2502.AH5(MMC2:DAT0)
N$213: U2502.AH4(MMC2:DAT1)
N$214: U2502.AG4(MMC2:DAT2)
N$215: U2502.AF4(MMC2:DAT3)
NRESWARM-CPU: U2502.AF24(BOOT:SYS_NRESWARM) ; also sheet 32,33
Unconnected: U2502.AE14(BOOT:SYS_BOOT2) U2502.AE21(BOOT:SYS_BOOT5) U2502.AF18(BOOT:SYS_BOOT3) U2502.AF19(BOOT:SYS_BOOT4) U2502.AF21(BOOT:SYS_BOOT6) U2502.AF26(BOOT:SYS_NIRQ) U2502.AG26(BOOT:SYS_BOOT1) U2502.AH25(BOOT:SYS_NRESPWRON) U2502.AH26(BOOT:SYS_BOOT0) U2502.M27(MMC1:CMD) U2502.N25(MMC1:DAT2) U2502.N26(MMC1:DAT1) U2502.N27(MMC1:DAT0) U2502.N28(MMC1:CLK) U2502.P26(MMC1:DAT5) U2502.P27(MMC1:DAT4) U2502.P28(MMC1:DAT3) U2502.R25(MMC1:DAT7) U2502.R27(MMC1:DAT6)

### Notes on the sheet
- INCOMPLETE in V2
- CPU + PoP RAM/NAND
- V2b
- (c) 2014 Golden Delicious Computers GmbH&Co. KG. Licensed under CC-BY-SA.

## Sheet 27 of 38
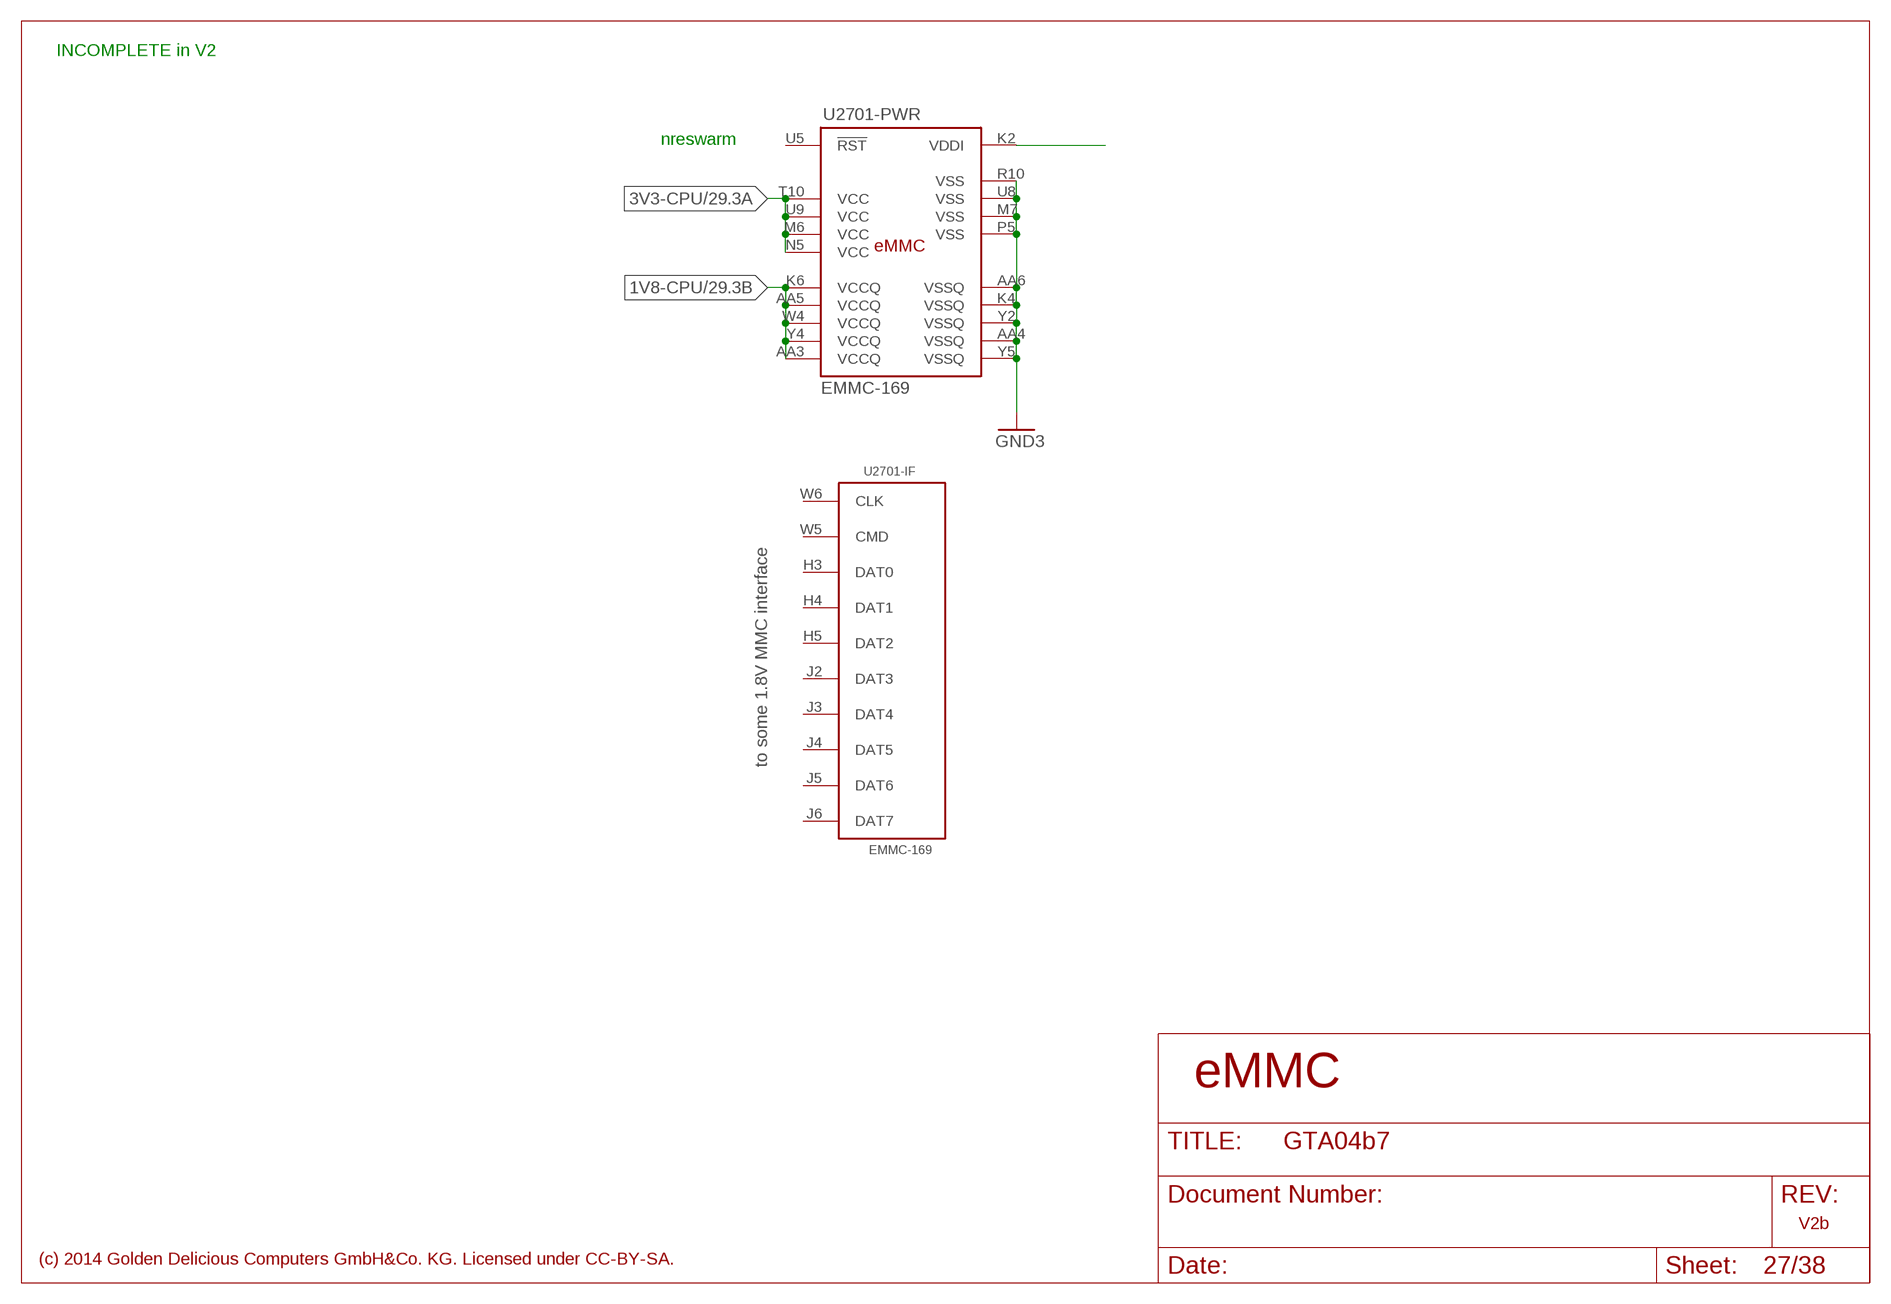
[diagram p30: schematic, sheet 27]

### Parts
U2701  EMMC-169  [EMMC-BGA-N169-0.5]

### Nets
1V8-CPU: U2701.AA3(-PWR:VCCQ) U2701.AA5(-PWR:VCCQ) U2701.K6(-PWR:VCCQ) U2701.W4(-PWR:VCCQ) U2701.Y4(-PWR:VCCQ) ; also sheet 23,24,25,29,30,32
3V3-CPU: U2701.M6(-PWR:VCC) U2701.N5(-PWR:VCC) U2701.T10(-PWR:VCC) U2701.U9(-PWR:VCC) ; also sheet 29
GND3 [GND]: U2701.AA4(-PWR:VSSQ) U2701.AA6(-PWR:VSSQ) U2701.K4(-PWR:VSSQ) U2701.M7(-PWR:VSS) U2701.P5(-PWR:VSS) U2701.R10(-PWR:VSS) U2701.U8(-PWR:VSS) U2701.Y2(-PWR:VSSQ) U2701.Y5(-PWR:VSSQ) ; supply symbol labelled GND-3 ; also sheet 22,23,24,25,28,29,30,31,32,33
N$4: U2701.K2(-PWR:VDDI)
Unconnected: U2701.H3(-IF:DAT0) U2701.H4(-IF:DAT1) U2701.H5(-IF:DAT2) U2701.J2(-IF:DAT3) U2701.J3(-IF:DAT4) U2701.J4(-IF:DAT5) U2701.J5(-IF:DAT6) U2701.J6(-IF:DAT7) U2701.U5(-PWR:!RST) U2701.W5(-IF:CMD) U2701.W6(-IF:CLK)

### Notes on the sheet
- INCOMPLETE in V2
- nreswarm
- to some 1.8V MMC interface
- eMMC
- V2b
- (c) 2014 Golden Delicious Computers GmbH&Co. KG. Licensed under CC-BY-SA.

## Sheet 28 of 38
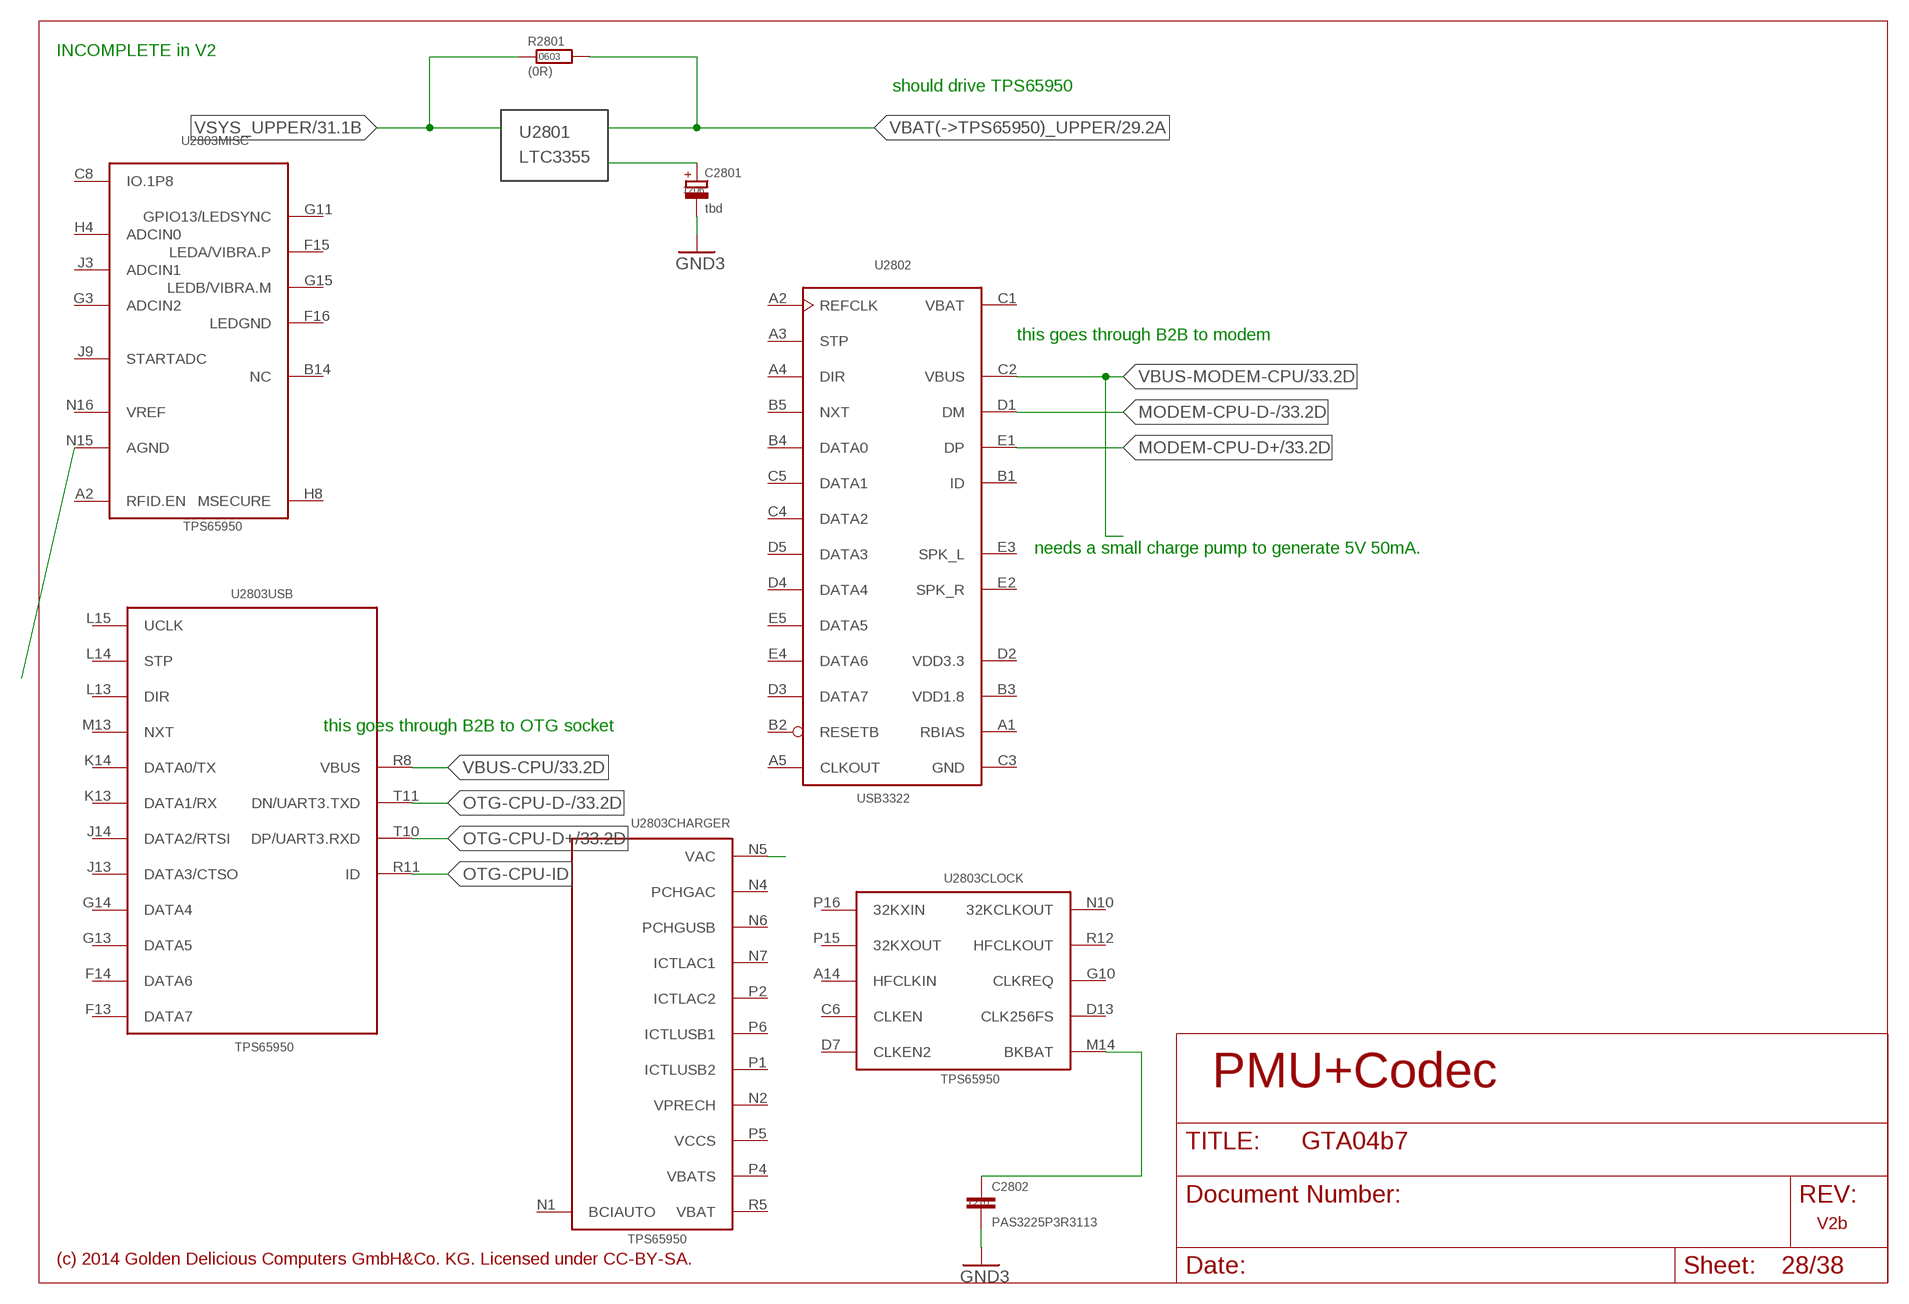
[diagram p31: schematic, sheet 28]

### Parts
C2801  tbd  C-POL1206  [SMD-1206]
C2802  PAS3225P3R3113  C1210  [SMD-1210]
R2801  (0R)  R0603  [SMD-0603]  (not fitted in variant Full)  (not fitted in variant BB-XM)
U2801  LTC3355  MECHANICAL  [NONE]
U2802  USB3322  USB332XC-GJ-TR  [WLCSP25-N25-0.4]
U2803  TPS65950  [PBGA256-N213-0.4]

### Nets
GND3 [GND]: C2801.2(-) C2802.2 ; supply symbol labelled GND-3 ; also sheet 22,23,24,25,27,29,30,31,32,33
MODEM-CPU-D+: U2802.E1(DP) ; also sheet 33
MODEM-CPU-D-: U2802.D1(DM) ; also sheet 33
N$16: U2803.N5(CHARGER:VAC)
N$52: C2801.1(+)
N$67: U2803.N15(MISC:AGND)
N$79: C2802.1 U2803.M14(CLOCK:BKBAT)
OTG-CPU-D+: U2803.T10(USB:DP/UART3.RXD) ; also sheet 33
OTG-CPU-D-: U2803.T11(USB:DN/UART3.TXD) ; also sheet 33
OTG-CPU-ID: U2803.R11(USB:ID)
VBAT(->TPS65950)_UPPER: R2801.2 ; also sheet 29
VBUS-CPU: U2803.R8(USB:VBUS) ; also sheet 33
VBUS-MODEM-CPU: U2802.C2(VBUS) ; also sheet 2,33
VSYS_UPPER: R2801.1 ; also sheet 31,32,33
Unconnected: U2802.A1(RBIAS) U2802.A2(REFCLK) U2802.A3(STP) U2802.A4(DIR) U2802.A5(CLKOUT) U2802.B1(ID) U2802.B2(RESETB) U2802.B3(VDD1.8) U2802.B4(DATA0) U2802.B5(NXT) U2802.C1(VBAT) U2802.C3(GND) U2802.C4(DATA2) U2802.C5(DATA1) U2802.D2(VDD3.3) U2802.D3(DATA7) U2802.D4(DATA4) U2802.D5(DATA3) U2802.E2(SPK_R) U2802.E3(SPK_L) U2802.E4(DATA6) U2802.E5(DATA5) U2803.A1(GPIO/JTAG/TEST:TEST) U2803.A2(MISC:RFID.EN) U2803.A6(AUDIO:EAR.P) U2803.A7(AUDIO:EAR.M) U2803.A10(CONTROL:REGEN) U2803.A11(CONTROL:PWRON) U2803.A13(CONTROL:NRESPWRON) U2803.A14(CLOCK:HFCLKIN) U2803.A15(GPIO/JTAG/TEST:JTAG.TDI/BERDATA) U2803.A16(GPIO/JTAG/TEST:TESTV2) U2803.B1(AUDIO:UART1.TXD) U2803.B4(AUDIO:HSOL) U2803.B5(AUDIO:HSOR) U2803.B7(AUDIO:PRE.L/VMID) U2803.B8(AUDIO:PRE.R/ADCIN7) U2803.B9(AUDIO:IHF.LEFT.P) U2803.B10(AUDIO:IHF.LEFT.M) U2803.B11(AUDIO:IHF.RIGHT.P) U2803.B12(AUDIO:IHF.RIGHT.M) U2803.B13(CONTROL:NRESWARM) U2803.B14(MISC:NC) U2803.B16(GPIO/JTAG/TEST:JTAG.TCK/BERCLK) U2803.C3(AUDIO:GPIO16/BT.PCM.VDR/DIG.MIC.CLK0) U2803.C4(CONTROL:I2C.SR.SDA/NC) U2803.C5(AUDIO:GPIO17/BT.PCM.VDX/DIG.MIC.CLK1) U2803.C6(CLOCK:CLKEN) U2803.C13(CONTROL:SYSEN) U2803.D1(AUDIO:MICBIAS1.OUT/VMIC1.OUT) U2803.D2(AUDIO:MICBIAS2.OUT/VMIC2.OUT) U2803.D4(CONTROL:I2C.CNTL.SDA) U2803.D5(CONTROL:I2C.CNTL.SCL) U2803.D6(CONTROL:I2C.SR.SCL/VMODE2) U2803.D7(CLOCK:CLKEN2) U2803.D8(AUDIO:GPIO8/UART1.RXD) U2803.D13(CLOCK:CLK256FS) U2803.E2(AUDIO:MIC.MAIN.P) U2803.E3(AUDIO:HSMIC.P) U2803.E4(AUDIO:VHSMIC.OUT) U2803.F1(AUDIO:AUXL) U2803.F2(AUDIO:MIC.MAIN.M) U2803.F3(AUDIO:HSMIC.M) U2803.F4(KEYPAD:KPD.C5) U2803.F7(KEYPAD:KPD.C3) U2803.F8(CONTROL:VMODE1) U2803.F9(CONTROL:INT2) U2803.F10(CONTROL:INT1) U2803.F13(USB:DATA7) U2803.F14(USB:DATA6) U2803.F15(MISC:LEDA/VIBRA.P) U2803.G1(AUDIO:AUXR) U2803.G2(AUDIO:MIC.SUB.P/DIG.MIC.0) U2803.G3(MISC:ADCIN2) U2803.G4(KEYPAD:KPD.C7) U2803.G6(KEYPAD:KPD.C2) U2803.G7(KEYPAD:KPD.C4) U2803.G8(KEYPAD:KPD.C0) U2803.G9(CONTROL:NSLEEP2) U2803.G10(CLOCK:CLKREQ) U2803.G11(MISC:GPIO13/LEDSYNC) U2803.G13(USB:DATA5) U2803.G14(USB:DATA4) U2803.G15(MISC:LEDB/VIBRA.M) U2803.H2(AUDIO:MIC.SUB.M/DIG.MIC.1) U2803.H4(MISC:ADCIN0) U2803.H6(KEYPAD:KPD.C6) U2803.H7(KEYPAD:KPD.C1) U2803.H8(MISC:MSECURE) U2803.J3(MISC:ADCIN1) U2803.J9(MISC:STARTADC) U2803.J10(KEYPAD:KBD.R5) U2803.J11(CONTROL:BOOT1) U2803.J13(USB:DATA3/CTSO) U2803.J14(USB:DATA2/RTSI) U2803.K3(CONTROL:I2S.DOUT) U2803.K4(CONTROL:I2S.DIN) U2803.K6(CONTROL:I2S.SYNC) U2803.K7(KEYPAD:KBD.R3) U2803.K8(KEYPAD:KBD.R1) U2803.K9(KEYPAD:KBD.R0) U2803.K10(KEYPAD:KBD.R6) U2803.K11(CONTROL:BOOT0) U2803.K13(USB:DATA1/RX) U2803.K14(USB:DATA0/TX) U2803.L3(CONTROL:I2S.CLK) U2803.L4(GPIO/JTAG/TEST:GPIO2/TEST1) U2803.L7(KEYPAD:KBD.R7) U2803.L8(KEYPAD:KBD.R2) U2803.L9(KEYPAD:KBD.R4) U2803.L10(MCPC:MANU) U2803.L13(USB:DIR) U2803.L14(USB:STP) U2803.L15(USB:UCLK) U2803.M4(GPIO/JTAG/TEST:GPIO6/PWM0/TEST3/MUTE) U2803.M13(USB:NXT) U2803.N1(CHARGER:BCIAUTO) U2803.N2(CHARGER:VPRECH) U2803.N4(CHARGER:PCHGAC) U2803.N6(CHARGER:PCHGUSB) U2803.N7(CHARGER:ICTLAC1) U2803.N8(MCPC:TXAF/ADCIN4) U2803.N9(MCPC:RXAF/ADCIN6) U2803.N10(CLOCK:32KCLKOUT) U2803.N11(MCPC:RTSO/ADCIN5) U2803.N12(GPIO/JTAG/TEST:GPIO1/CD2/JTAG.TMS) U2803.N14(GPIO/JTAG/TEST:GPIO7/VIBRA.SYNC/PWM1/TEST4) U2803.P1(CHARGER:ICTLUSB2) U2803.P2(CHARGER:ICTLAC2) U2803.P4(CHARGER:VBATS) U2803.P5(CHARGER:VCCS) U2803.P6(CHARGER:ICTLUSB1) U2803.P7(CONTROL:NSLEEP1) U2803.P8(USB-POWER:VINTUSB.1P5) U2803.P9(USB-POWER:VUSB.3P1) U2803.P10(USB-POWER:VINTUSB.1P8) U2803.P11(MCPC:CTSI/ADCIN3) U2803.P12(GPIO/JTAG/TEST:GPIO0/CD1/JTAG.TDO) U2803.P13(GPIO/JTAG/TEST:GPIO15/TEST2) U2803.P15(CLOCK:32KXOUT) U2803.P16(CLOCK:32KXIN) U2803.R1(CONTROL:PCM.VCK) U2803.R12(CLOCK:HFCLKOUT) U2803.R16(CONTROL:PCM.VFS) U2803.T1(GPIO/JTAG/TEST:TESTV1) U2803.T2(CONTROL:PCM.VDR) U2803.T6(USB-POWER:CP.CAPM) U2803.T7(USB-POWER:CP.CAPP) U2803.T15(CONTROL:PCM.VDX) U2803.T16(GPIO/JTAG/TEST:TEST.RESET)

### Notes on the sheet
- INCOMPLETE in V2
- should drive TPS65950
- this goes through B2B to modem
- needs a small charge pump to generate 5V 50mA.
- this goes through B2B to OTG socket
- PMU+Codec
- V2b
- (c) 2014 Golden Delicious Computers GmbH&Co. KG. Licensed under CC-BY-SA.

## Sheet 29 of 38
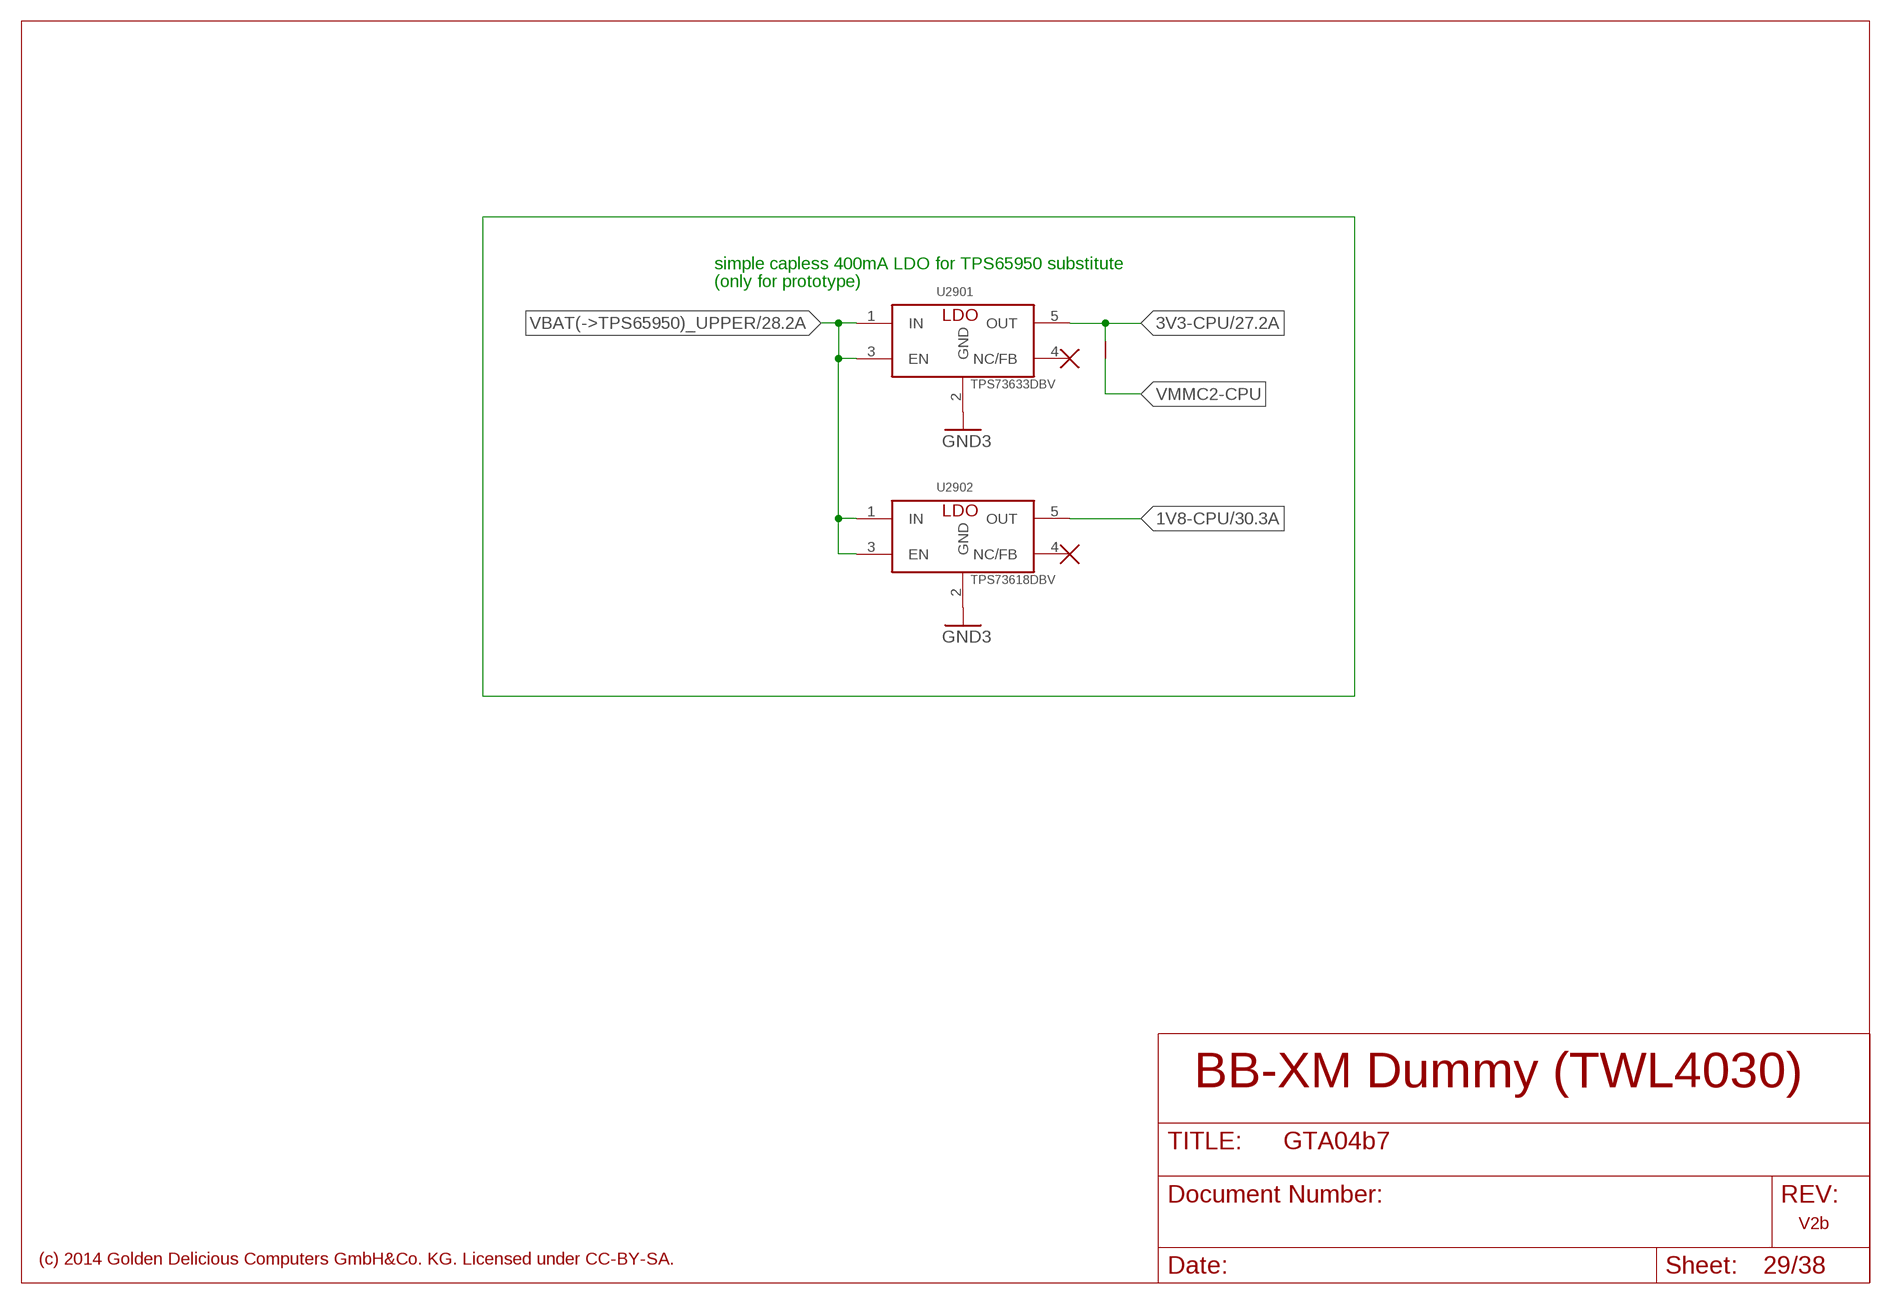
[diagram p32: schematic, sheet 29]

### Parts
N2901  0R  [0R]  (not fitted in variant Full)  (not fitted in variant BB-XM)
U2901  TPS73633DBV  TPS73630DBV  [SOT23-5]
U2902  TPS73618DBV  TPS73630DBV  [SOT23-5]

### Nets
1V8-CPU: U2902.5(OUT) ; also sheet 23,24,25,27,30,32
3V3-CPU: N2901.P$1 U2901.5(OUT) ; also sheet 27
GND3 [GND]: U2901.2(GND) U2902.2(GND) ; supply symbol labelled GND-3 ; also sheet 22,23,24,25,27,28,30,31,32,33
VBAT(->TPS65950)_UPPER: U2901.1(IN) U2901.3(EN) U2902.1(IN) U2902.3(EN) ; also sheet 28
VMMC2-CPU: N2901.P$2
Unconnected: U2901.4(NC/FB) U2902.4(NC/FB)

### Notes on the sheet
- simple capless 400mA LDO for TPS65950 substitute
- (only for prototype)
- BB-XM Dummy (TWL4030)
- V2b
- (c) 2014 Golden Delicious Computers GmbH&Co. KG. Licensed under CC-BY-SA.

## Sheet 30 of 38
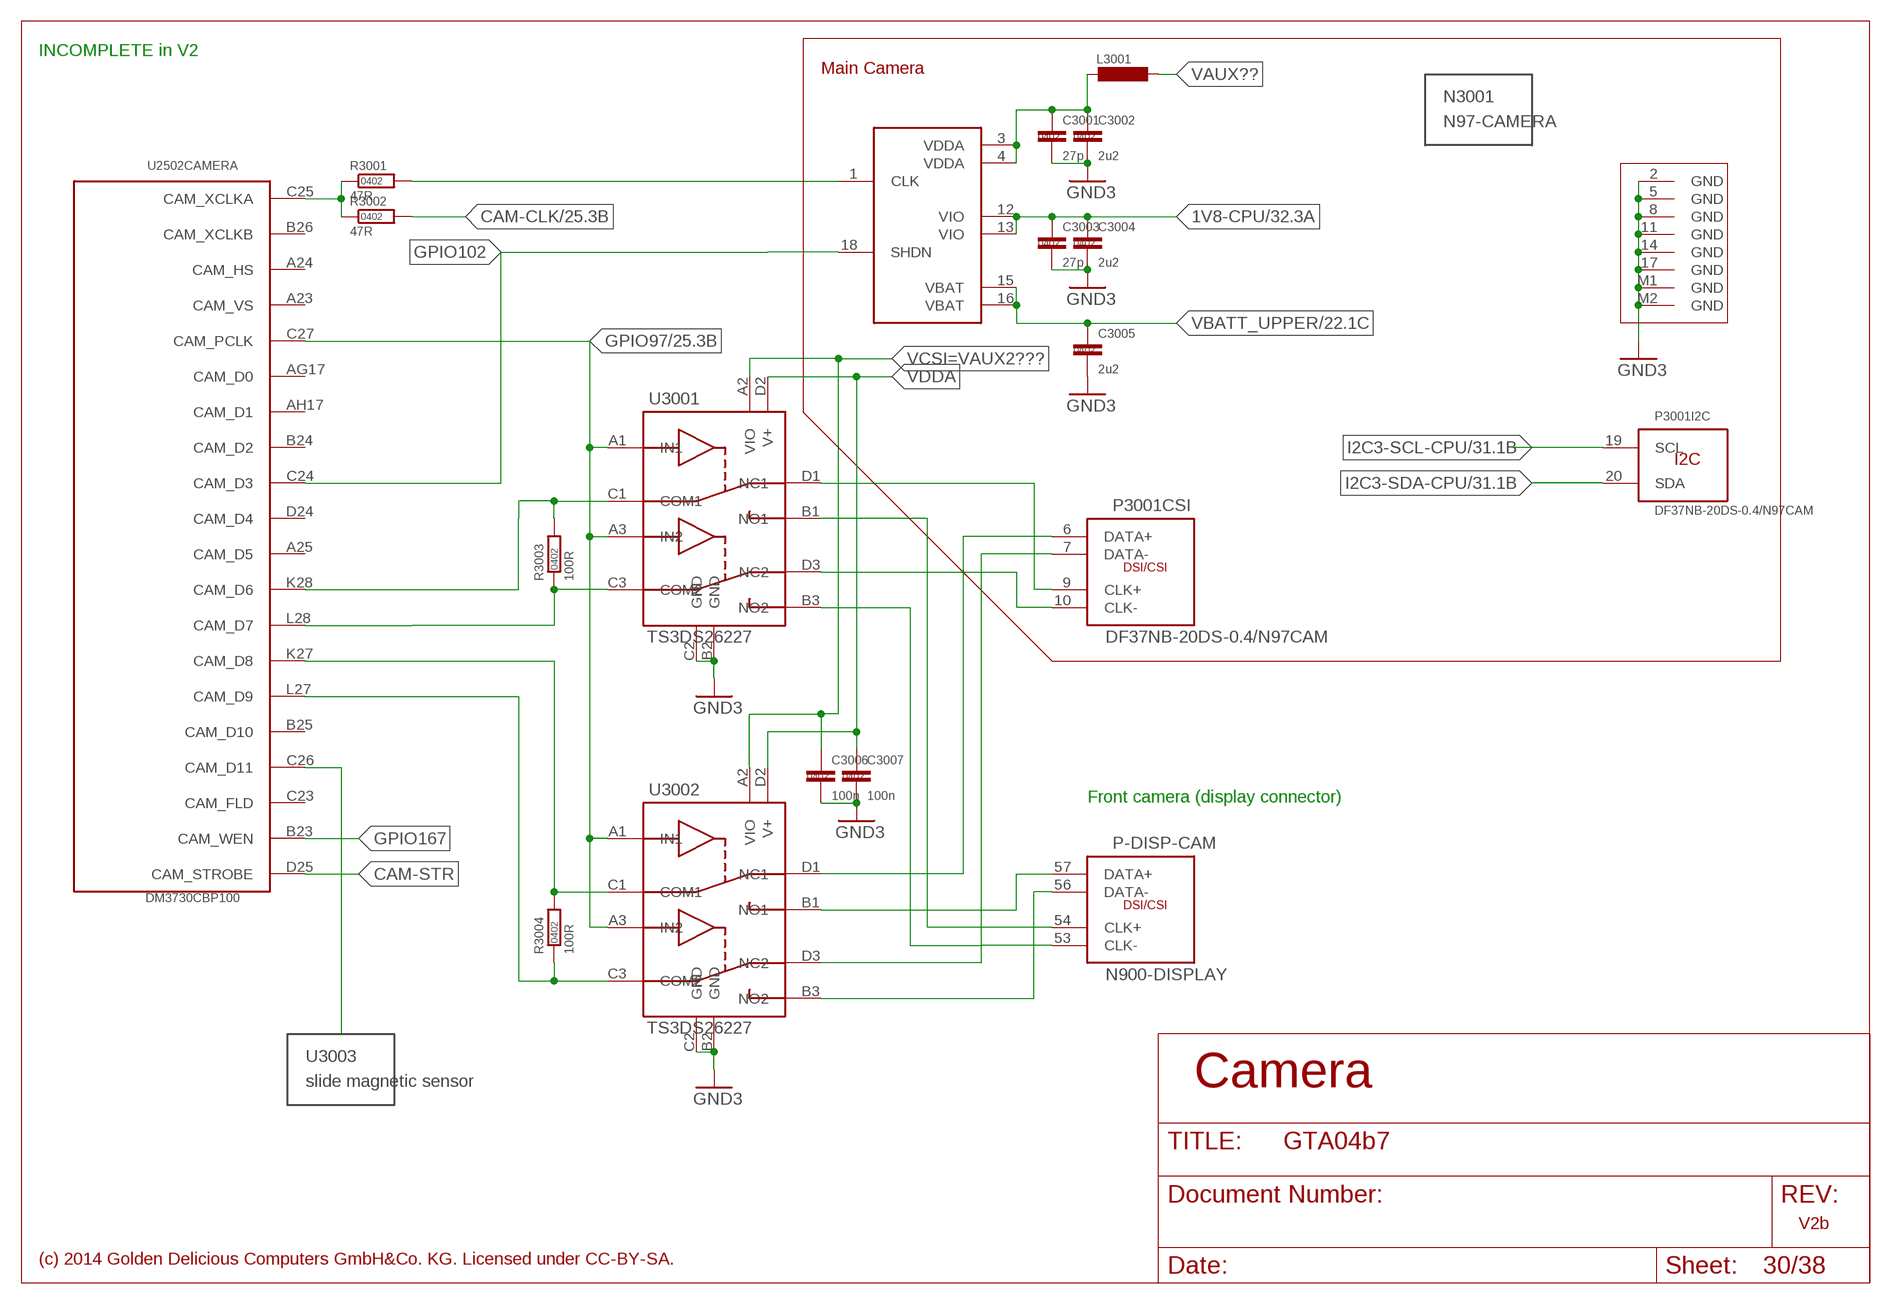
[diagram p33: schematic, sheet 30]

### Parts
C3001  27p  C0402  [SMD-0402]
C3002  2u2  C0402  [SMD-0402]
C3003  27p  C0402  [SMD-0402]
C3004  2u2  C0402  [SMD-0402]
C3005  2u2  C0402  [SMD-0402]
C3006  100n  C0402  [SMD-0402]
C3007  100n  C0402  [SMD-0402]
L3001  L0402  [SMD-0402]
N3001  N97-CAMERA  N900-CAMERAN97  [N97-CAMERA]
P3001  DF37NB-20DS-0.4/N97CAM  [DF37NB-20SD-0.4V]
R3001  47R  R0402  [SMD-0402]
R3002  47R  R0402  [SMD-0402]
R3003  100R  R0402  [SMD-0402]
R3004  100R  R0402  [SMD-0402]
U3001  TS3DS26227  TS3DS26227YZT  [R-XBGA-N12-0.5]
U3002  TS3DS26227  TS3DS26227YZT  [R-XBGA-N12-0.5]
U3003  slide magnetic sensor  MECHANICAL  [NONE]

### Nets
1V8-CPU: C3003.1 C3004.1 P3001.12(VIO) P3001.13(VIO) ; also sheet 23,24,25,27,29,32
CAM-CLK: R3002.2 ; also sheet 25
CAM-STR: U2502.D25(CAMERA:CAM_STROBE)
CSI-B-C+_UPPER: P-DISP.54(-CAM:CLK+) U3001.B1(NO1)
CSI-B-C-_UPPER: P-DISP.53(-CAM:CLK-) U3001.B3(NO2)
CSI-B-D+_UPPER: P-DISP.57(-CAM:DATA+) U3002.B1(NO1)
CSI-B-D-_UPPER: P-DISP.56(-CAM:DATA-) U3002.B3(NO2)
GND3 [GND]: C3001.2 C3002.2 C3003.2 C3004.2 C3005.2 C3006.2 C3007.2 P3001.2(GND1:GND) P3001.5(GND2:GND) P3001.8(GND3:GND) P3001.11(GND4:GND) P3001.14(GND5:GND) P3001.17(GND6:GND) P3001.M1(M1:GND) P3001.M2(M2:GND) U3001.B2(GND) U3001.C2(GND) U3002.B2(GND) U3002.C2(GND) ; supply symbol labelled GND-3 ; also sheet 22,23,24,25,27,28,29,31,32,33
GPIO97: U2502.C27(CAMERA:CAM_PCLK) U3001.A1(IN1) U3001.A3(IN2) U3002.A1(IN1) U3002.A3(IN2) ; also sheet 25
GPIO102: P3001.18(SHDN) U2502.C24(CAMERA:CAM_D3)
GPIO167: U2502.B23(CAMERA:CAM_WEN)
I2C3-SCL-CPU: P3001.19(I2C:SCL) ; also sheet 26,31,32,33
I2C3-SDA-CPU: P3001.20(I2C:SDA) ; also sheet 26,31,32,33
N$72: R3001.1 R3002.1 U2502.C25(CAMERA:CAM_XCLKA)
N$73: R3003.2 U2502.K28(CAMERA:CAM_D6) U3001.C1(COM1)
N$74: C3001.1 C3002.1 L3001.2 P3001.3(VDDA) P3001.4(VDDA)
N$75: P3001.6(CSI:DATA+) U3002.D1(NC1)
N$76: P3001.7(CSI:DATA-) U3002.D3(NC2)
N$77: P3001.9(CSI:CLK+) U3001.D1(NC1)
N$78: P3001.10(CSI:CLK-) U3001.D3(NC2)
N$80: P3001.1(CLK) R3001.2
N$173: R3004.2 U2502.K27(CAMERA:CAM_D8) U3002.C1(COM1)
N$174: R3004.1 U2502.L27(CAMERA:CAM_D9) U3002.C3(COM2)
N$176: R3003.1 U2502.L28(CAMERA:CAM_D7) U3001.C3(COM2)
N$177: U2502.C26(CAMERA:CAM_D11)
VAUX??: L3001.1
VBATT_UPPER [Battery]: C3005.1 P3001.15(VBAT) P3001.16(VBAT) ; also sheet 22,25
VCSI=VAUX2???: C3006.1 U3001.A2(VIO) U3002.A2(VIO)
VDDA: C3007.1 U3001.D2(V+) U3002.D2(V+)
Unconnected: U2502.A23(CAMERA:CAM_VS) U2502.A24(CAMERA:CAM_HS) U2502.A25(CAMERA:CAM_D5) U2502.AG17(CAMERA:CAM_D0) U2502.AH17(CAMERA:CAM_D1) U2502.B24(CAMERA:CAM_D2) U2502.B25(CAMERA:CAM_D10) U2502.B26(CAMERA:CAM_XCLKB) U2502.C23(CAMERA:CAM_FLD) U2502.D24(CAMERA:CAM_D4)

### Notes on the sheet
- INCOMPLETE in V2
- Main Camera
- Front camera (display connector)
- Camera
- V2b
- (c) 2014 Golden Delicious Computers GmbH&Co. KG. Licensed under CC-BY-SA.

## Sheet 31 of 38
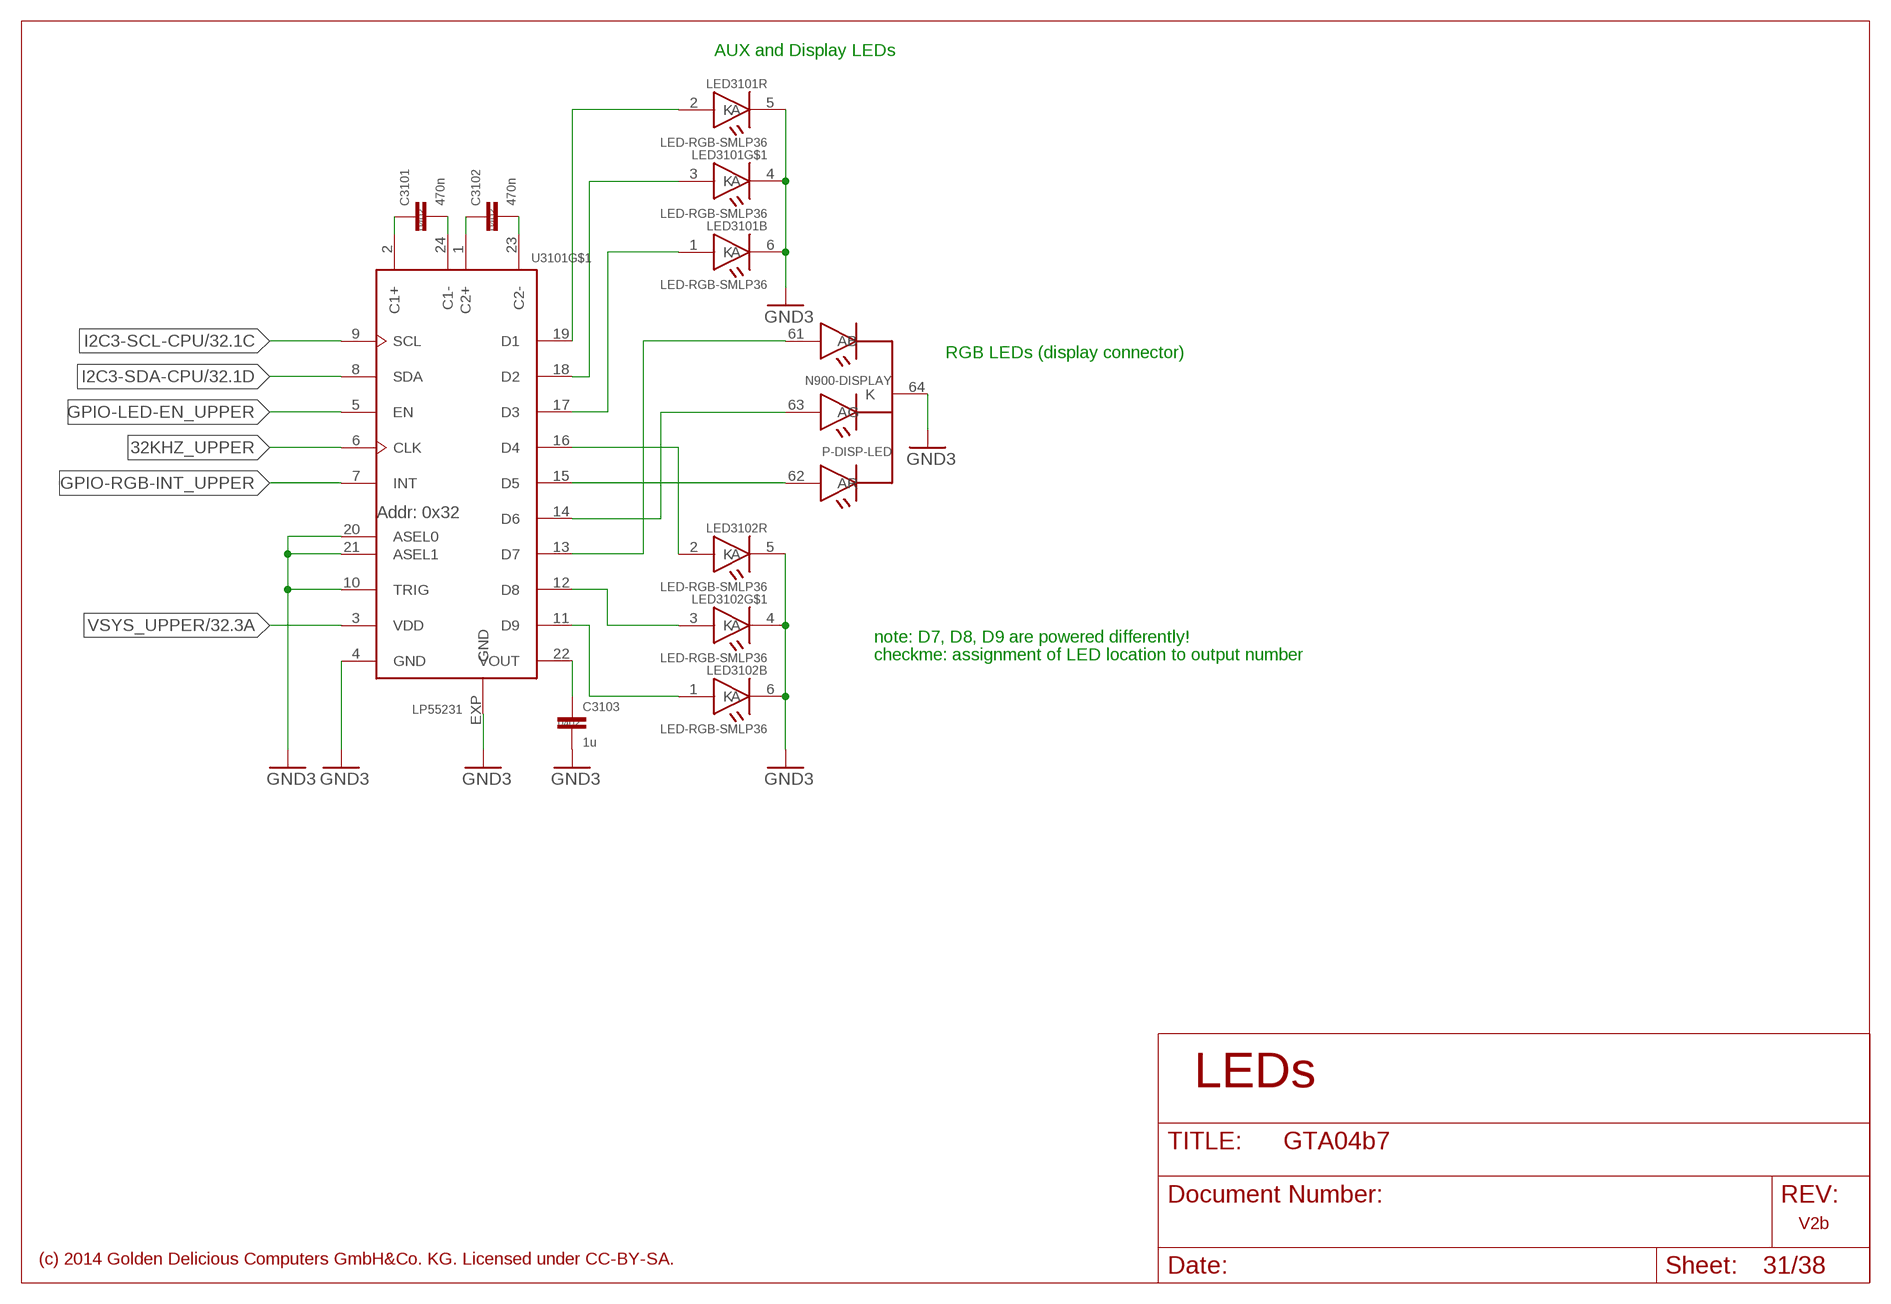
[diagram p34: schematic, sheet 31]

### Parts
C3101  470n  C0402  [SMD-0402]
C3102  470n  C0402  [SMD-0402]
C3103  1u  C0402  [SMD-0402]
LED3101  LED-RGB-SMLP36  [SMLP36RGB2W3]
LED3102  LED-RGB-SMLP36  [SMLP36RGB2W3]
U3101  LP55231  [QFN-24+E-0.5]

### Nets
32KHZ_UPPER: U3101.6(CLK)
GND3 [GND]: C3103.2 LED3101.4(K) LED3101.5(R:K) LED3101.6(B:K) LED3102.4(K) LED3102.5(R:K) LED3102.6(B:K) P-DISP.64(-LED:K) U3101.4(GND) U3101.10(TRIG) U3101.20(ASEL0) U3101.21(ASEL1) U3101.EXP(GND) ; supply symbol labelled GND-3 ; also sheet 22,23,24,25,27,28,29,30,32,33
GPIO-LED-EN_UPPER: U3101.5(EN)
GPIO-RGB-INT_UPPER: U3101.7(INT)
I2C3-SCL-CPU: U3101.9(SCL) ; also sheet 26,30,32,33
I2C3-SDA-CPU: U3101.8(SDA) ; also sheet 26,30,32,33
N$14_UPPER: P-DISP.61(-LED:AB) U3101.13(D7)
N$15_UPPER: P-DISP.63(-LED:AG) U3101.14(D6)
N$17_UPPER: LED3101.2(R:A) U3101.19(D1)
N$18_UPPER: LED3101.3(A) U3101.18(D2)
N$19_UPPER: LED3101.1(B:A) U3101.17(D3)
N$20_UPPER: LED3102.2(R:A) U3101.16(D4)
N$21_UPPER: LED3102.3(A) U3101.12(D8)
N$22_UPPER: LED3102.1(B:A) U3101.11(D9)
N$42_UPPER: C3101.1 U3101.2(C1+)
N$46_UPPER: C3101.2 U3101.24(C1-)
N$47_UPPER: C3102.1 U3101.1(C2+)
N$48_UPPER: C3102.2 U3101.23(C2-)
N$58_UPPER: C3103.1 U3101.22(VOUT)
N$110: P-DISP.62(-LED:AR) U3101.15(D5)
VSYS_UPPER: U3101.3(VDD) ; also sheet 28,32,33

### Notes on the sheet
- AUX and Display LEDs
- RGB LEDs (display connector)
- Addr: 0x32
- note: D7, D8, D9 are powered differently!
- checkme: assignment of LED location to output number
- LEDs
- V2b
- (c) 2014 Golden Delicious Computers GmbH&Co. KG. Licensed under CC-BY-SA.